# Altium project HGT-300.PrjPCB
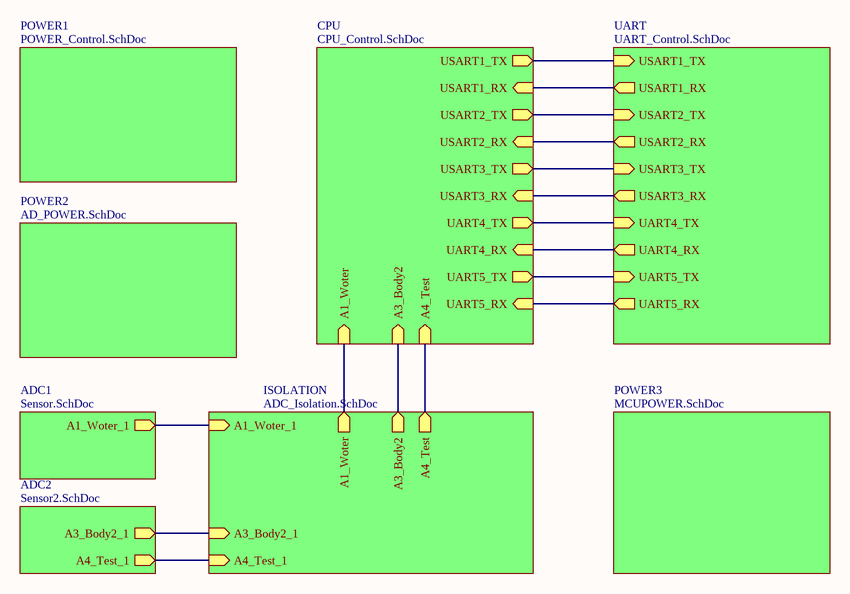
[diagram p0: SYSTEM_Control.SchDoc]
9 sheets, 434 parts. Net scope: hierarchical (ports join the sheet entries above them; power ports are global).
Board files: HGT-300.PcbDoc, 安装尺寸.PcbDoc, HGT-301.PcbDoc
Sheets:
  SYSTEM_Control.SchDoc
    CPU = CPU_Control.SchDoc
    POWER1 = POWER_Control.SchDoc
    UART = UART_Control.SchDoc
    POWER2 = AD_POWER.SchDoc
    ADC1 = Sensor.SchDoc
    ADC2 = Sensor2.SchDoc
    ISOLATION = ADC_Isolation.SchDoc
    POWER3 = MCUPOWER.SchDoc

## Sheet SYSTEM_Control.SchDoc
size A4

### Sub-sheets
ADC1 = Sensor.SchDoc: A1_Woter_1 (out)
ADC2 = Sensor2.SchDoc: A3_Body2_1 (out), A4_Test_1 (out)
CPU = CPU_Control.SchDoc: USART1_TX (out), USART1_RX (in), A1_Woter (in), A3_Body2 (in), A4_Test (in), UART4_TX (out), UART4_RX (in), UART5_TX (out), USART3_RX (in), USART3_TX (out), USART2_RX (in), USART2_TX (out), UART5_RX (in)
ISOLATION = ADC_Isolation.SchDoc: A1_Woter_1 (in), A3_Body2_1 (in), A4_Test_1 (in), A1_Woter (out), A3_Body2 (out), A4_Test (out)
POWER1 = POWER_Control.SchDoc: no entries
POWER2 = AD_POWER.SchDoc: no entries
POWER3 = MCUPOWER.SchDoc: no entries
UART = UART_Control.SchDoc: USART1_RX (out), USART1_TX (in), UART4_TX (in), UART4_RX (out), USART2_TX (in), USART2_RX (out), USART3_TX (in), UART5_TX (in), UART5_RX (out), USART3_RX (out)

### Nets
ADC1: sheet CPU/A3_Body2, sheet ISOLATION/A3_Body2
ADC2: sheet CPU/A4_Test, sheet ISOLATION/A4_Test
ADC3: sheet CPU/A1_Woter, sheet ISOLATION/A1_Woter
Pc12: sheet CPU/UART5_TX, sheet UART/UART5_TX
PD2: sheet CPU/UART5_RX, sheet UART/UART5_RX
UART4_RX: sheet CPU/UART4_RX, sheet UART/UART4_RX
UART4_TX: sheet CPU/UART4_TX, sheet UART/UART4_TX
NetC115_1: sheet ADC2/A3_Body2_1, sheet ISOLATION/A3_Body2_1
NetC124_1: sheet ADC2/A4_Test_1, sheet ISOLATION/A4_Test_1
NetC133_1: sheet ADC1/A1_Woter_1, sheet ISOLATION/A1_Woter_1
NetR27_1: sheet CPU/USART3_RX, sheet UART/USART3_RX
NetR28_1: sheet CPU/USART3_TX, sheet UART/USART3_TX
NetR31_1: sheet CPU/USART1_TX, sheet UART/USART1_TX
NetR32_1: sheet CPU/USART1_RX, sheet UART/USART1_RX
NetU2_86: sheet CPU/USART2_TX, sheet UART/USART2_TX
NetU2_87: sheet CPU/USART2_RX, sheet UART/USART2_RX

## Sheet CPU_Control.SchDoc
size A2
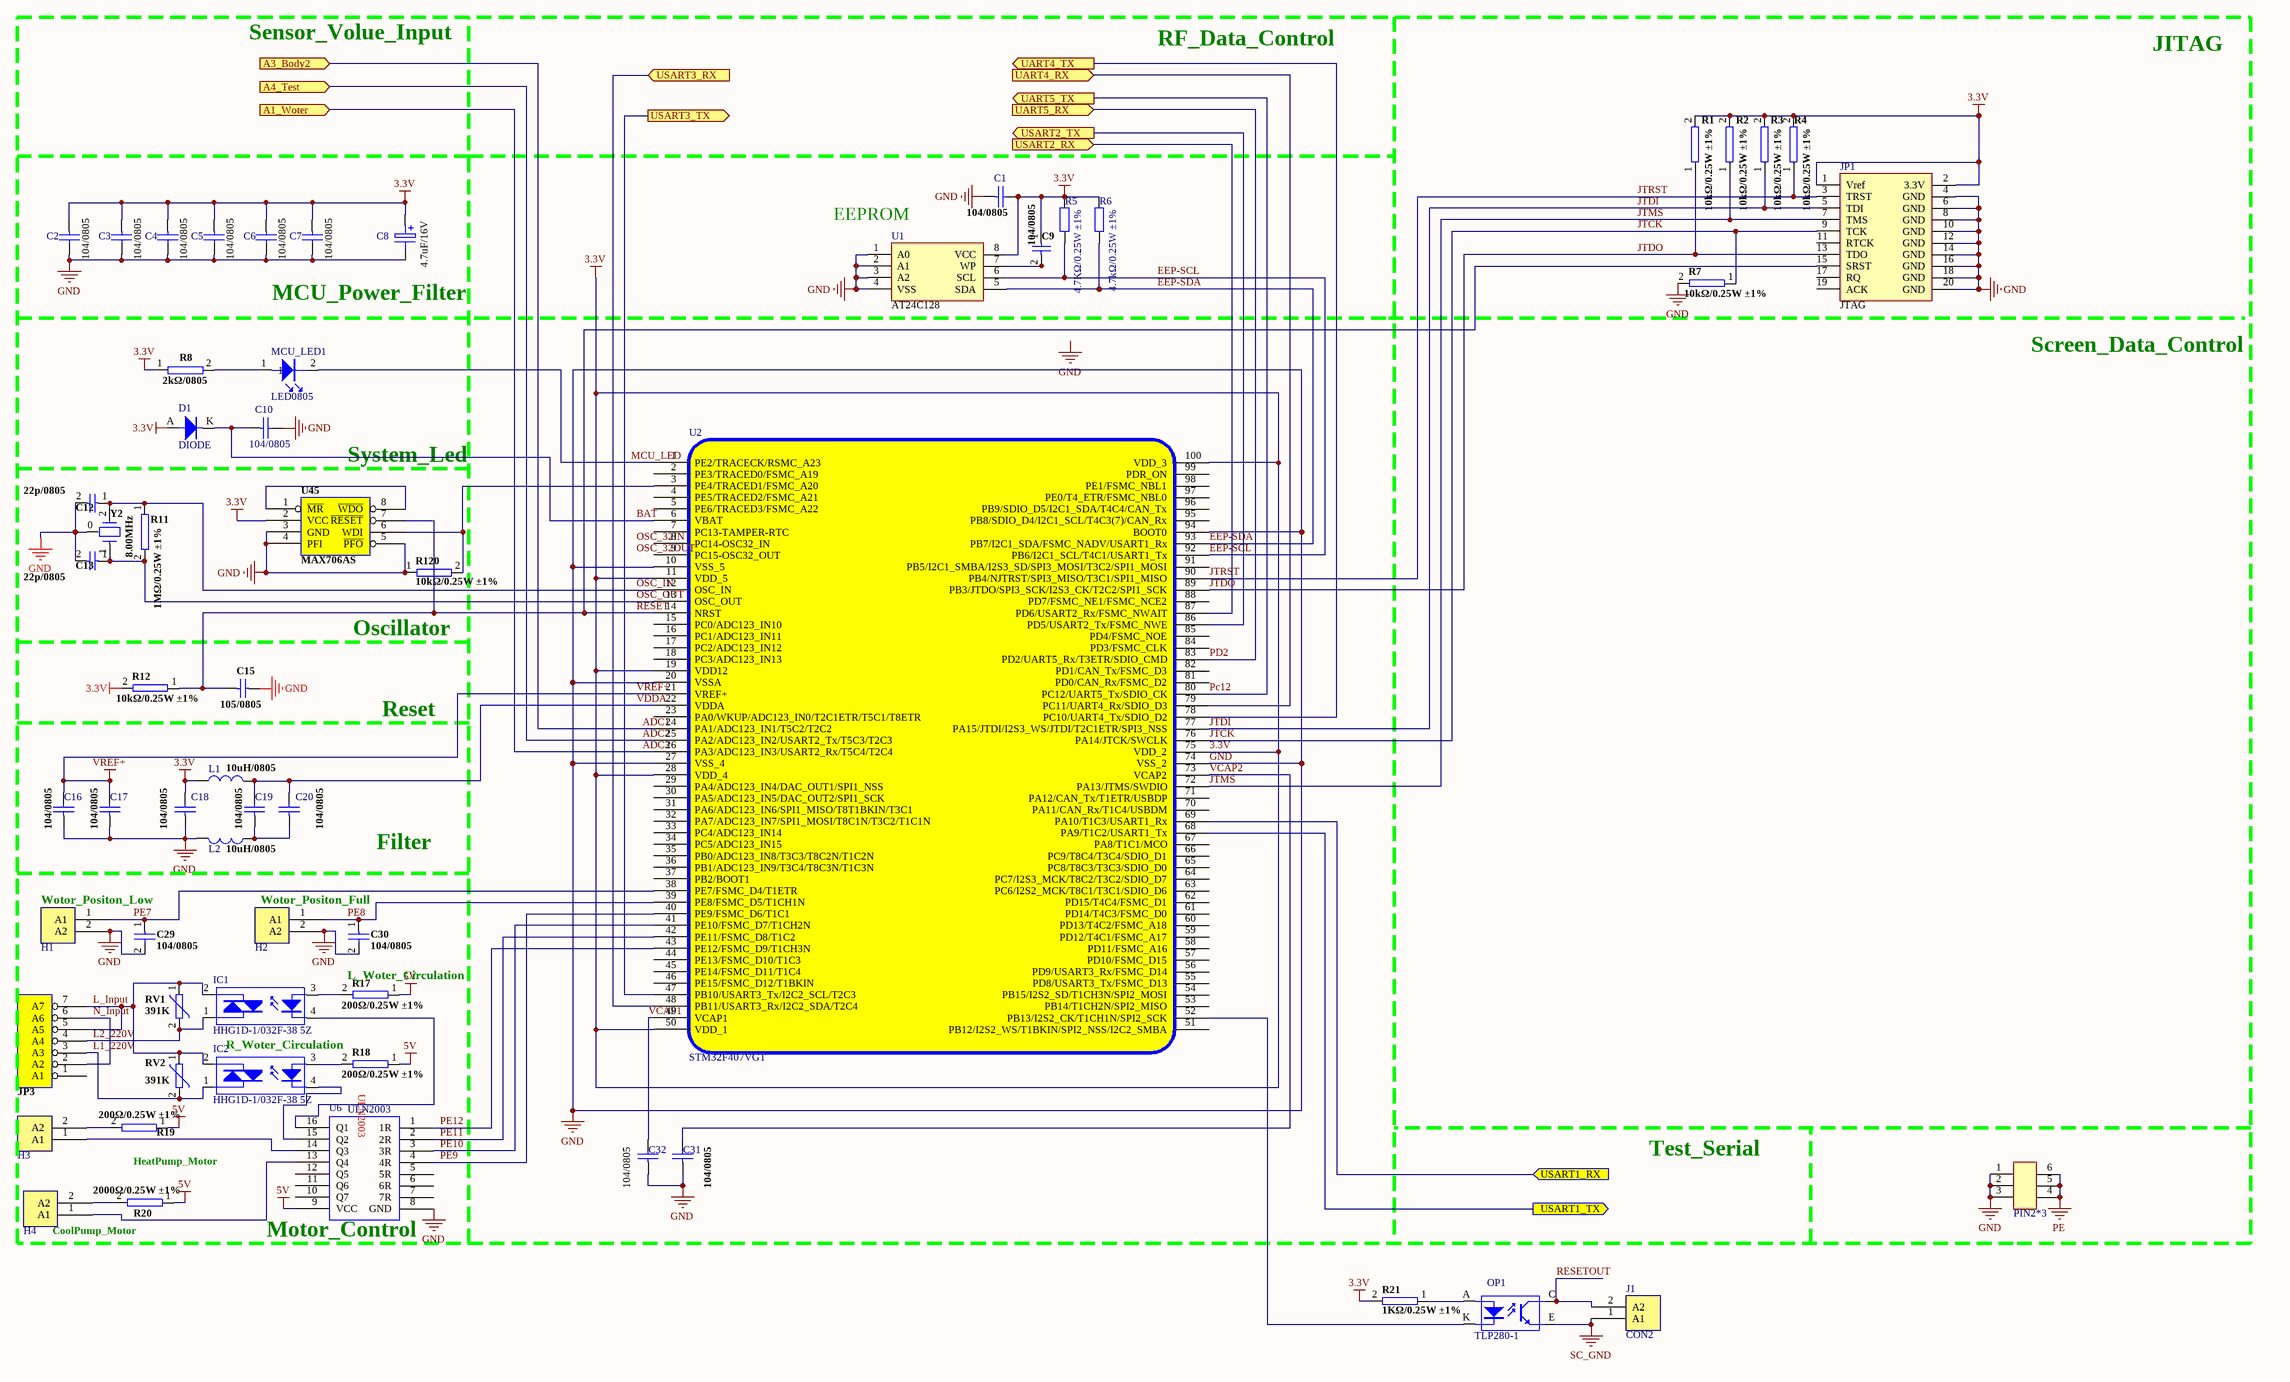
[diagram p1: CPU_Control.SchDoc]

### Parts
C1  104/0805  [C0805]
C2  104/0805  [C0805]
C3  104/0805  [C0805]
C4  104/0805  [C0805]
C5  104/0805  [C0805]
C6  104/0805  [C0805]
C7  104/0805  [C0805]
C8  4.7uF/16V  [CAP5X5]
C9  104/0805  [C0805]
C10  104/0805  [C0805]
C12  22p/0805  [C0805]
C13  22p/0805  [C0805]
C15  105/0805  [C0805]
C16  104/0805  [C0805]
C17  104/0805  [C0805]
C18  104/0805  [C0805]
C19  104/0805  [C0805]
C20  104/0805  [C0805]
C29  104/0805  [C0805]
C30  104/0805  [C0805]
C31  104/0805  [C0805]
C32  104/0805  [C0805]
D1  DIODE  [SOD123]
H1  L_Wotor_Port  [XH2]  (value not drawn)
H2  F_Wotor_Port  [XH2]  (value not drawn)
H3  Heat_Port  [XH2]  (value not drawn)
H4  Cool_Port  [XH2]  (value not drawn)
IC1  HHG1D-1/032F-38 5Z  [HHG1-REALY]
IC2  HHG1D-1/032F-38 5Z  [HHG1-REALY]
J1  CON2  [2Pin-2.54]
JP1  JTAG  [IDC20_A]
JP3  L_N_Port  [HEADER1x7]  (value not drawn)
L1  10uH/0805  [L0805]
L2  10uH/0805  [L0805]
MCU_LED1  LED0805  [LED_0805]
OP1  TLP280-1  [SOP4]
PE1  PIN2*3  [IDC2x3]
R1  10kΩ/0.25W ±1%  [R0805]
R2  10kΩ/0.25W ±1%  [R0805]
R3  10kΩ/0.25W ±1%  [R0805]
R4  10kΩ/0.25W ±1%  [R0805]
R5  4.7KΩ/0.25W ±1%  [R0805]
R6  4.7kΩ/0.25W ±1%  [R0805]
R7  10kΩ/0.25W ±1%  [R0805]
R8  2kΩ/0805  [R0805]
R11  1MΩ/0.25W ±1%  [R0805]
R12  10kΩ/0.25W ±1%  [R0805]
R17  200Ω/0.25W ±1%  [R0805]
R18  200Ω/0.25W ±1%  [R0805]
R19  200Ω/0.25W ±1%  [R0805]
R20  2000Ω/0.25W ±1%  [R0805]
R21  1KΩ/0.25W ±1%  [R0805]
R120  10kΩ/0.25W ±1%  [R0805]
RV1  391K  [RV0.3]
RV2  391K  [RV0.3]
U1  AT24C128  [SO-8]
U2  STM32F407VGT  [LQFP-100]
U6  ULN2003  [SOIC-16]
U45  MAX706AS  [SO-8]
Y2  8.00MHz  [XTAL_SOCKET]

### Ports
A1_Woter (in), A3_Body2 (in), A4_Test (in), UART4_RX (in), UART4_TX (out), UART5_RX (in), UART5_TX (out), USART1_RX (in), USART1_TX (out), USART2_RX (in), USART2_TX (out), USART3_RX (in), USART3_TX (out)

### Nets
3.3V: C1.2 C2.1 C3.1 C4.1 C5.1 C6.1 C7.1 C8.1 C9.1 C18.2 D1.A JP1.1(Vref) JP1.2(3.3V) L1.1 R1.2 R2.2 R3.2 R4.2 R5.2 R6.2 R8.1 R12.2 R21.2 U1.8(VCC) U2.11(VDD_5) U2.19(VDD12) U2.28(VDD_4) U2.50(VDD_1) U2.75(VDD_2) U2.100(VDD_3) U45.2(VCC)
5V: R17.1 R18.1 R19.1 R20.1 U6.9(VCC)
GND: C1.1 C2.2 C3.2 C4.2 C5.2 C6.2 C7.2 C8.2 C10.2 C12.2 C13.2 C15.1 C16.1 C17.1 C18.1 C29.2 C30.2 C31.1 C32.1 H1.2(A2) H2.2(A2) JP1.4(GND) JP1.6(GND) JP1.8(GND) JP1.10(GND) JP1.12(GND) JP1.14(GND) JP1.16(GND) JP1.18(GND) JP1.20(GND) L2.1 PE1.1 PE1.2 PE1.3 R7.2 R120.1 U1.1(A0) U1.2(A1) U1.3(A2) U1.4(VSS) U2.10(VSS_5) U2.20(VSSA) U2.27(VSS_4) U2.74(VSS_2) U2.94(BOOT0) U6.8(GND) U45.3(GND) U45.4(PFI) U45.5(~{PFO}) Y2.0
PE: PE1.4 PE1.5 PE1.6
SC_GND: J1.1(A1) OP1.E
VREF+: C16.2 C17.2 U2.21(VREF+)
ADC1: U2.24(PA1/ADC123_IN1/T5C2/T2C2) ; port A3_Body2
ADC2: U2.25(PA2/ADC123_IN2/USART2_Tx/T5C3/T2C3) ; port A4_Test
ADC3: U2.26(PA3/ADC123_IN3/USART2_Rx/T5C4/T2C4) ; port A1_Woter
BAT: C10.1 D1.K U2.6(VBAT)
EEP-SCL: R5.1 U1.6(SCL) U2.92(PB6/I2C1_SCL/T4C1/USART1_Tx)
EEP-SDA: R6.1 U1.5(SDA) U2.93(PB7/I2C1_SDA/FSMC_NADV/USART1_Rx)
JTCK: JP1.9(TCK) R7.1 U2.76(PA14/JTCK/SWCLK)
JTDI: JP1.5(TDI) R3.1 U2.77(PA15/JTDI/I2S3_WS/JTDI/T2C1ETR/SPI3_NSS)
JTDO: JP1.13(TDO) R1.1 U2.89(PB3/JTDO/SPI3_SCK/I2S3_CK/T2C2/SPI1_SCK)
JTMS: JP1.7(TMS) R2.1 U2.72(PA13/JTMS/SWDIO)
JTRST: JP1.3(TRST) R4.1 U2.90(PB4/NJTRST/SPI3_MISO/T3C1/SPI1_MISO)
L1_220V: IC2.1 JP3.3(A3) RV2.2
L2_220V: IC1.1 JP3.4(A4) RV1.2
L_Input: IC1.2 IC2.2 JP3.5(A5) JP3.7(A7) RV1.1 RV2.1
MCU_LED: MCU_LED1.2 U2.1(PE2/TRACECK/RSMC_A23)
N_Input: JP3.2(A2) JP3.6(A6)
OSC_IN: C12.1 R11.1 U2.12(OSC_IN) Y2.2
OSC_OUT: C13.1 R11.2 U2.13(OSC_OUT) Y2.1
Pc12: U2.80(PC12/UART5_Tx/SDIO_CK) ; port UART5_TX
PD2: U2.83(PD2/UART5_Rx/T3ETR/SDIO_CMD) ; port UART5_RX
PE7: C29.1 H1.1(A1) U2.38(PE7/FSMC_D4/T1ETR)
PE8: C30.1 H2.1(A1) U2.39(PE8/FSMC_D5/T1CH1N)
PE9: U2.40(PE9/FSMC_D6/T1C1) U6.4(4R)
PE10: U2.41(PE10/FSMC_D7/T1CH2N) U6.3(3R)
PE11: U2.42(PE11/FSMC_D8/T1C2) U6.2(2R)
PE12: U2.43(PE12/FSMC_D9/T1CH3N) U6.1(1R)
RESET: C15.2 JP1.15(SRST) R12.1 U2.14(NRST) U45.7(~{RESET})
RESETOUT: J1.2(A2) OP1.C
UART4_RX: U2.79(PC11/UART4_Rx/SDIO_D3) ; port UART4_RX
UART4_TX: U2.78(PC10/UART4_Tx/SDIO_D2) ; port UART4_TX
VCAP1: C32.2 U2.49(VCAP1)
VCAP2: C31.2 U2.73(VCAP2)
VDDA: C19.2 C20.2 L1.2 U2.22(VDDA)
NetC9_2: C9.2 U1.7(WP)
NetC19_1: C19.1 C20.1 L2.2
NetH3_1: H3.1(A1) U6.14(Q3)
NetH3_2: H3.2(A2) R19.2
NetH4_1: H4.1(A1) U6.13(Q4)
NetH4_2: H4.2(A2) R20.2
NetIC1_3: IC1.3 R17.2
NetIC1_4: IC1.4 U6.16(Q1)
NetIC2_3: IC2.3 R18.2
NetIC2_4: IC2.4 U6.15(Q2)
NetMCU_LED1_1: MCU_LED1.1 R8.2
NetOP1_A: OP1.A R21.1
NetOP1_K: OP1.K U2.52(PB13/I2S2_CK/T1CH1N/SPI2_SCK)
NetR27_1: U2.48(PB11/USART3_Rx/I2C2_SDA/T2C4) ; port USART3_RX
NetR28_1: U2.47(PB10/USART3_Tx/I2C2_SCL/T2C3) ; port USART3_TX
NetR31_1: U2.68(PA9/T1C2/USART1_Tx) ; port USART1_TX
NetR32_1: U2.69(PA10/T1C3/USART1_Rx) ; port USART1_RX
NetR120_2: R120.2 U2.3(PE4/TRACED1/FSMC_A20) U45.6(WDI)
NetU2_86: U2.86(PD5/USART2_Tx/FSMC_NWE) ; port USART2_TX
NetU2_87: U2.87(PD6/USART2_Rx/FSMC_NWAIT) ; port USART2_RX
NetU45_1: U45.1(~{MR}) U45.8(~{WDO})

Not connected (* = marked no-connect by the designer): JP1 11(RTCK) 17(RQ) 19(ACK); JP3 1(A1); U2 2(PE3/TRACED0/FSMC_A19) 4(PE5/TRACED2/FSMC_A21) 5(PE6/TRACED3/FSMC_A22) 7(PC13-TAMPER-RTC) 8(PC14-OSC32_IN) 9(PC15-OSC32_OUT) 15(PC0/ADC123_IN10) 16(PC1/ADC123_IN11) 17(PC2/ADC123_IN12) 18(PC3/ADC123_IN13) 23(PA0/WKUP/ADC123_IN0/T2C1ETR/T5C1/T8ETR) 29(PA4/ADC123_IN4/DAC_OUT1/SPI1_NSS) 30(PA5/ADC123_IN5/DAC_OUT2/SPI1_SCK) 31(PA6/ADC123_IN6/SPI1_MISO/T8T1BKIN/T3C1) 32(PA7/ADC123_IN7/SPI1_MOSI/T8C1N/T3C2/T1C1N) 33(PC4/ADC123_IN14) 34(PC5/ADC123_IN15) 35(PB0/ADC123_IN8/T3C3/T8C2N/T1C2N) 36(PB1/ADC123_IN9/T3C4/T8C3N/T1C3N) 37(PB2/BOOT1) 44(PE13/FSMC_D10/T1C3) 45(PE14/FSMC_D11/T1C4) 46(PE15/FSMC_D12/T1BKIN) 51(PB12/I2S2_WS/T1BKIN/SPI2_NSS/I2C2_SMBA) 53(PB14/T1CH2N/SPI2_MISO) 54(PB15/I2S2_SD/T1CH3N/SPI2_MOSI) 55(PD8/USART3_Tx/FSMC_D13) 56(PD9/USART3_Rx/FSMC_D14) 57(PD10/FSMC_D15) 58(PD11/FSMC_A16) 59(PD12/T4C1/FSMC_A17) 60(PD13/T4C2/FSMC_A18) 61(PD14/T4C3/FSMC_D0) 62(PD15/T4C4/FSMC_D1) 63(PC6/I2S2_MCK/T8C1/T3C1/SDIO_D6) 64(PC7/I2S3_MCK/T8C2/T3C2/SDIO_D7) 65(PC8/T8C3/T3C3/SDIO_D0) 66(PC9/T8C4/T3C4/SDIO_D1) 67(PA8/T1C1/MCO) 70(PA11/CAN_Rx/T1C4/USBDM) 71(PA12/CAN_Tx/T1ETR/USBDP) 81(PD0/CAN_Rx/FSMC_D2) 82(PD1/CAN_Tx/FSMC_D3) 84(PD3/FSMC_CLK) 85(PD4/FSMC_NOE) 88(PD7/FSMC_NE1/FSMC_NCE2) 91(PB5/I2C1_SMBA/I2S3_SD/SPI3_MOSI/T3C2/SPI1_MOSI) 95(PB8/SDIO_D4/I2C1_SCL/T4C3(7)/CAN_Rx) 96(PB9/SDIO_D5/I2C1_SDA/T4C4/CAN_Tx) 97(PE0/T4_ETR/FSMC_NBL0) 98(PE1/FSMC_NBL1) 99(PDR_ON); U6 5(5R) 6(6R) 7(7R) 10(Q7) 11(Q6) 12(Q5)

### Notes on the sheet
- Sensor_Volue_Input
- RF_Data_Control
- JITAG
- (near U1) EEPROM
- MCU_Power_Filter
- Screen_Data_Control
- (near U45) System_Led
- (near R120) Oscillator
- Reset
- Filter
- (near H1) Wotor_Positon_Low
- (near H2) Wotor_Positon_Full
- L_Woter_Circulation
- R_Woter_Circulation
- HeatPump_Motor
- Test_Serial
- (near H4) CoolPump_Motor
- (near U6) Motor_Control
- Labels drawn without touching a wire or pin: GND, OSC_32IN, OSC_32OUT

### Library data of the parts
C1-C7 C16-C20 C29-C32 = CAP: 贴片电容 104/25V ±1% C0805
C8 = ELECTRO1: 贴片钽电容 4.7uF/16V ±10% CAP5X5
C9 = CAP: 贴片电容 104/25V ±1% C0805; Part Field 1: 08-500106-06
C10 = CAP: 贴片电容 104/50V ±1% C0805
C12 C13 = CAP: 贴片电容 22pF/25V ±1% C0805
C15 = CAP: 贴片电容 105/25V ±1% C0805; Value: 100pF; Published: 8-Jun-2000; Revision: July-2002: Re-released for DXP Platform.; Publisher: Altium Limited
D1 = DIODE: 高速开关二极管 IN4148 1V 150mA SOD123
H1-H4 = CON2: 插座式端子 XH2.54-2P 250V(DC/AC) 3A
IC1 IC2 = OPTOTRIAC: 固态继电器 HHG1D-1/032F-38 5Z HHG1-REALY
J1 = CON2: 单排排针（2针）2.54mm 2Pin-2.54
JP1 = JTAG20: 双排排针（10针）2.54mm IDC20_A
JP3 = CON7: 接线端子 22-12AWG 300V 20A 间距8.5mm/HEADER1x7
L1 L2 = INDUCTOR1: 贴片电感 10uH/L0805/0.25W ±10%
MCU_LED1 = LED0805: 贴片LED灯 2.0V 20mA 蓝色 LED_0805
OP1 = TLP521: 光耦 TLP280-1 SOP4
PE1 = PIN2*3: 双排排针（3针）2.54mm IDC2x3
R1-R4 R7 R12 R120 = RES2: 贴片电阻 10kΩ 0.25W ±1% R0805
R5 = Res2: 贴片电阻 4.7kΩ 0.25W ±1% R0805; Value: 4.7K/0805; Published: 8-Jun-2000; LatestRevisionDate: 17-Jul-2002; LatestRevisionNote: Re-released for DXP Platform.; PackageReference: AXIAL-0.4; Publisher: Altium Limited
R6 = Res2: 贴片电阻 4.7kΩ/0.25W ±1% R0805; Value: 4.7ΩK/0.25W; Published: 8-Jun-2000; LatestRevisionDate: 17-Jul-2002; LatestRevisionNote: Re-released for DXP Platform.; PackageReference: AXIAL-0.4; Publisher: Altium Limited
R8 = RES2: 贴片电阻 2kΩ 0.25W ±1% R0805; Part Field 1: 06-115611-18
R11 = RES2: 贴片电阻 1MΩ 0.25W ±1% R0805
R17-R19 = RES2: 贴片电阻 200Ω 0.25W ±1% R0805
R20 = RES2: 贴片电阻 2kΩ 0.25W ±1% R0805
R21 = RES2: 贴片电阻 1kΩ 0.25W ±1% R0805
RV1 RV2 = VARISTOR: 压敏电阻 391K 340V ±10% RV0.3
U1 = 24WC02: 存储器 EEPROM 芯片 AT24C128 SO-8
U2 = STM32F407VGT: STM32F407单片机 STM32F407VGT LQFP-100
U6 = ULN2003: 达林顿三极管集成IC ULN2003 SOIC-16
U45 = MAX705CPA: 看门狗IC MAX706AS SO-8
Y2 = CRYSTAL: 晶振 8.00MHz XTAL_SOCKET; 物?: *; 部?: *; 供?: *

## Sheet POWER_Control.SchDoc
size A4
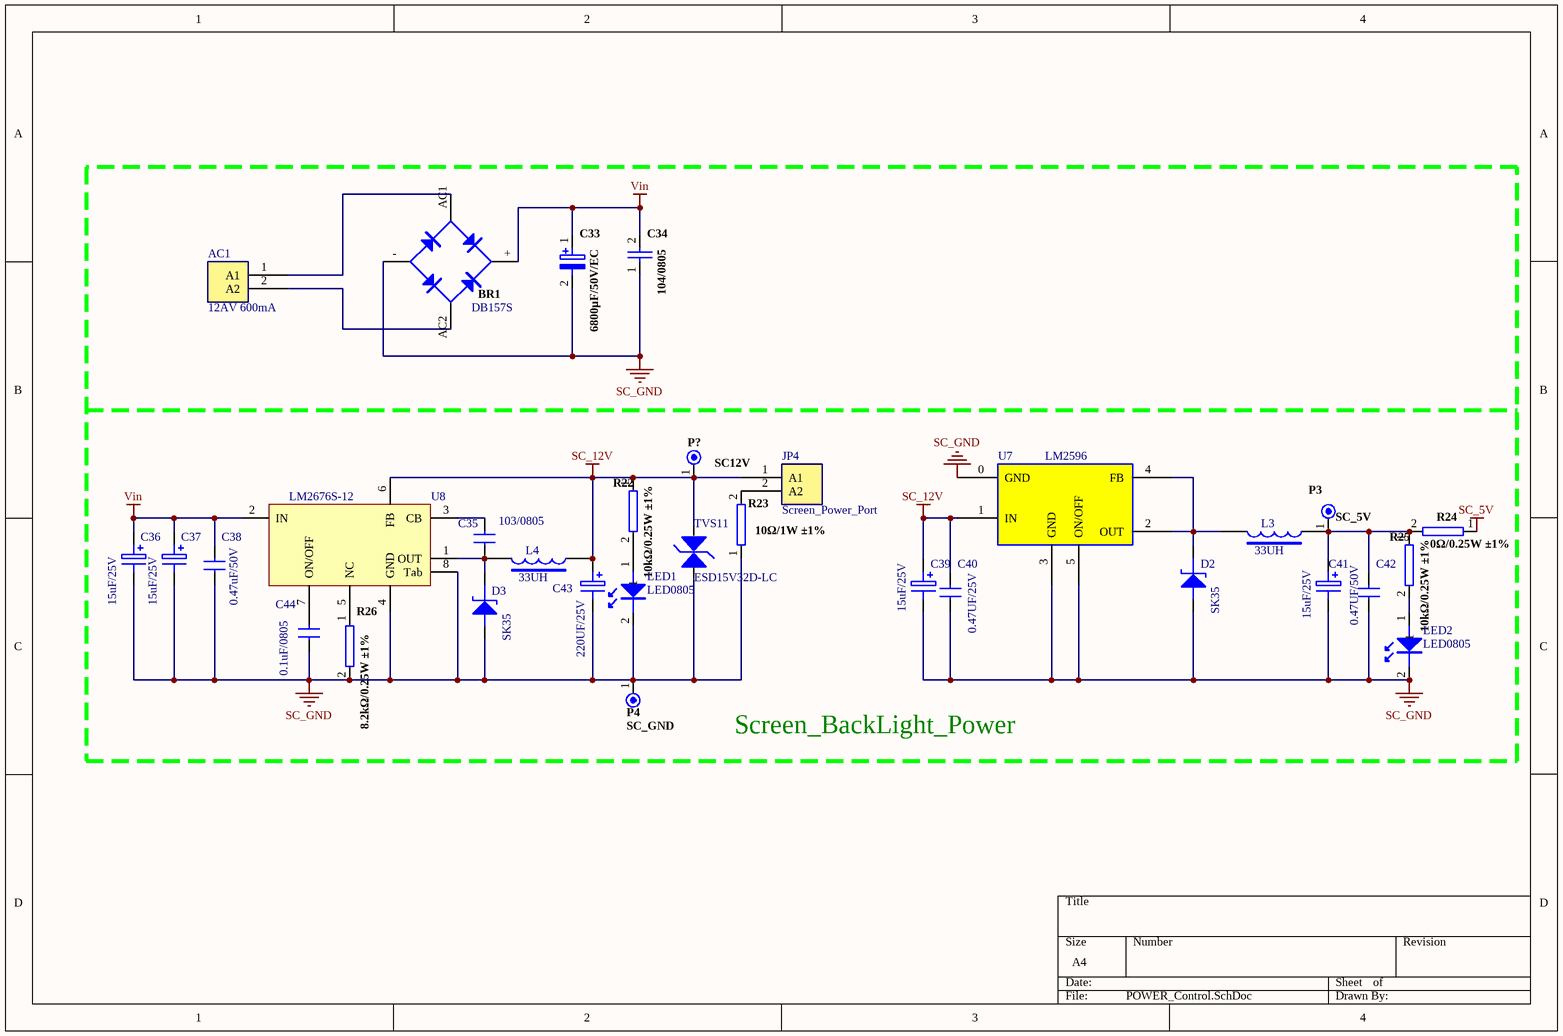
[diagram p2: POWER_Control.SchDoc]

### Parts
AC1  12AV 600mA  [HEADER2]
BR1  DB157S  [DB157S]
C33  6800μF/50V/EC  [RB.4/8]
C34  104/0805  [C0805]
C35  103/0805  [C0805]
C36  15uF/25V  [C6032]
C37  15uF/25V  [C6032]
C38  0.47uF/50V  [C0805]
C39  15uF/25V  [C6032]
C40  value 0.47UF/25V  [C0805]  (hidden comment: 0.47uF/50V)
C41  15uF/25V  [C6032]
C42  0.47uF/50V  [C0805]
C43  220UF/25V  [C10X10]
C44  value 0.1uF/0805  [C0805]  (hidden comment: 0.47UF/50V)
D2  SK35  [SMB-2]
D3  SK35  [SMB-2]
JP4  Screen_Power_Port  [HEADER1X2B]
L3  33UH  [M-SMB7X7]
L4  33UH  [M-SMB7X7]
LED1  LED0805  [LED_0805]
LED2  LED0805  [LED_0805]
P3  SC_5V  [TESTSMD]
P4  SC_GND  [TESTSMD]
P?  SC12V  [TESTSMD]
R22  10kΩ/0.25W ±1%  [R0805]
R23  10Ω/1W ±1%  [R0805]
R24  0Ω/0.25W ±1%  [R0805]
R25  10kΩ/0.25W ±1%  [R0805]
R26  8.2kΩ/0.25W ±1%  [R0805]
TVS11  ESD15V32D-LC  [SOD323]
U7  LM2596  [TO263]
U8  LM2676S-12  [TO-263-7]

### Blocks framed on the sheet
Screen_BackLight_Power: AC1 BR1 C33-C44 D2 D3 JP4 L3 L4 LED1 LED2 P3 P4 P? R22-R26 TVS11 U7 U8

### Nets
SC_5V: R24.1
SC_12V: C39.1 C40.2 C43.1 JP4.1(A1) L4.2 P?.1 R22.1 TVS11.1 U7.1(IN) U8.6(FB)
SC_GND: BR1.-(V-) C33.2 C34.1 C36.2 C37.2 C38.1 C39.2 C40.1 C41.2 C42.1 C43.2 C44.2 D2.1(A) D3.1(A) LED1.2 LED2.2 P4.1 R23.1 R26.2 TVS11.2 U7.0(GND) U7.3(GND) U7.5(ON/OFF) U8.4(GND) U8.8(Tab)
Vin: BR1.+(V+) C33.1 C34.2 C36.1 C37.1 C38.2 U8.2(IN)
NetAC1_1: AC1.1(A1) BR1.AC1
NetAC1_2: AC1.2(A2) BR1.AC2
NetC35_1: C35.1 U8.3(CB)
NetC35_2: C35.2 D3.2(K) L4.1 U8.1(OUT)
NetC41_1: C41.1 C42.2 L3.2 P3.1 R24.2 R25.1
NetC44_1: C44.1 U8.7(ON/OFF)
NetD2_2: D2.2(K) L3.1 U7.2(OUT) U7.4(FB)
NetJP4_2: JP4.2(A2) R23.2
NetLED1_1: LED1.1 R22.2
NetLED2_1: LED2.1 R25.2
NetR26_1: R26.1 U8.5(NC)

### Library data of the parts
AC1 = CON2: 接线端子 AWG14-22 300VAC 16A 5.0mm HEADER2
BR1 = NBRIDGE1: 贴片整流桥 DB157S 50A/1000V
C33 = ELECTRO2: 电解电容 6800μF/50V/EC ±5% RB.3/.6
C34 = CAP: 贴片电容 104/25V ±1% C0805
C35 = CAP: 贴片电容 103/25V ±1% C0805; Value: 103/0805
C36 C37 = ELECTRO1: 贴片钽电容 15uF/25V ±10% C6032; Comme: 15uF/25V/钽电容
C38 C40 C42 = CAP: 贴片电容 0.47uF/50V ±1% C0805
  C38 C42: Value: 0.47UF/50V
C39 C41 = ELECTRO1: 贴片钽电容 15uF/25V ±10% C6032
C43 = ELECTRO1: 贴片钽电容 220uF/25V ±10% C10X10
C44 = CAP: 贴片电容 0.47uF/25V ±1% C0805
D2 D3 = ZENER2: 稳压二极管 SK35 50V 3.0A SMB-2
JP4 = CON2: 连接器 WAFER 2PIN/3.96/自锁 HEADER1X2B
L3 L4 = INDUCTOR2: 贴片电感 33uH 1/4W ±10% M-SMB7X7
LED1 LED2 = LED0805: 贴片LED灯 蓝色 2.0V 20mA LED_0805
P3 P4 P? = CON1
R22 R25 = RES2: 贴片电阻 10kΩ 0.25W ±1% R0805; Part Field 1: 06-115611-18; Par: 电阻
R23 = RES2: 贴片电阻 10Ω/1W ±1% R0805
R24 = RES2: 贴片电阻 0Ω 0.25W ±1% R0805
R26 = RES2: 贴片电阻 8.2kΩ 0.25W ±1% R0805; Part Field 1: 06-115611-18; Par: 电阻
TVS11 = TVS: ESD静电二极管 ESD15V32D-LC 8V 15KV 40A SOD323
U7 = LM2596: 5VDC-DC开关电源IC LM2596 TO263
U8 = LM2676: 12DC-DC开关电源IC LM2676S-12 TO-263-7

## Sheet UART_Control.SchDoc
size A4
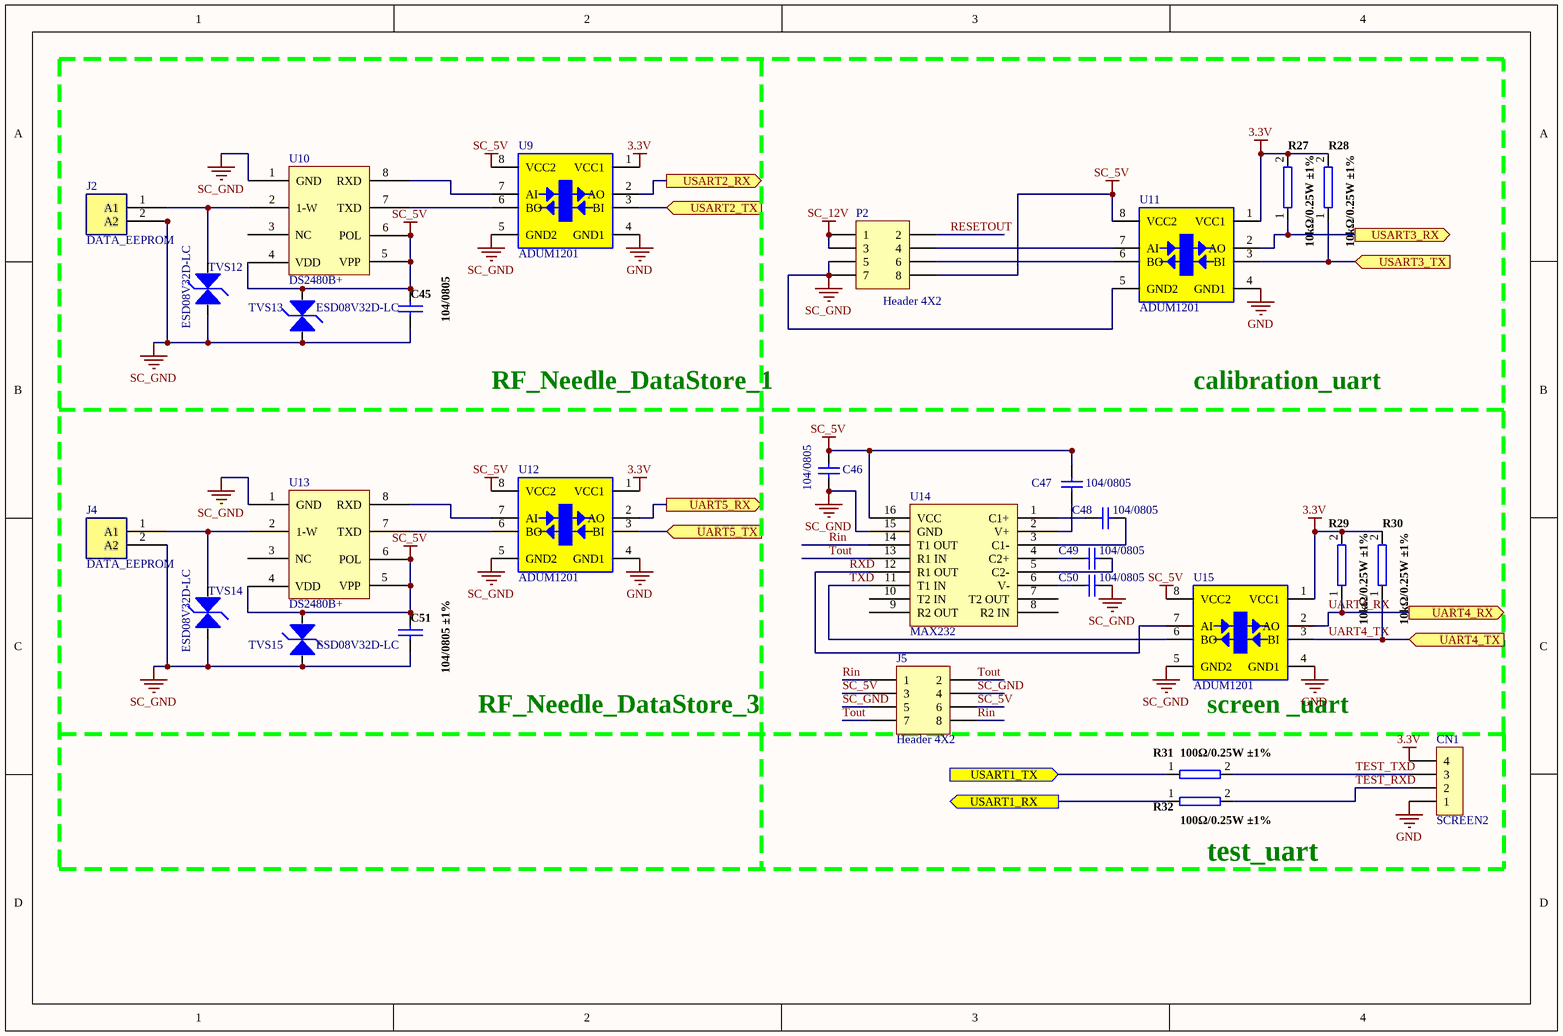
[diagram p3: UART_Control.SchDoc]

### Parts
C45  104/0805  [C0805]
C46  104/0805  [C0805]
C47  104/0805  [C0805]
C48  104/0805  [C0805]
C49  104/0805  [C0805]
C50  104/0805  [C0805]
C51  104/0805 ±1%  [C0805]
CN1  SCREEN2  [4Pin-2.54]
J2  DATA_EEPROM  [XH2]
J4  DATA_EEPROM  [XH2]
J5  Header 4X2  [IDC4*2]
P2  Header 4X2  [RJ45]
R27  10kΩ/0.25W ±1%  [R0805]
R28  10kΩ/0.25W ±1%  [R0805]
R29  10kΩ/0.25W ±1%  [R0805]
R30  10kΩ/0.25W ±1%  [R0805]
R31  100Ω/0.25W ±1%  [R0805]
R32  100Ω/0.25W ±1%  [R0805]
TVS12  ESD08V32D-LC  [SOD323]
TVS13  ESD08V32D-LC  [SOD323]
TVS14  ESD08V32D-LC  [SOD323]
TVS15  ESD08V32D-LC  [SOD323]
U9  ADUM1201  [SOIC8_N]
U10  DS2480B+  [SOIC8_N]
U11  ADUM1201  [SOIC8_N]
U12  ADUM1201  [SOIC8_N]
U13  DS2480B+  [SOIC8_N]
U14  MAX232  [SOP16]
U15  ADUM1201  [SOIC8_N]

### Ports
UART4_RX (out), UART4_TX (in), UART5_RX (out), UART5_TX (in), USART1_RX (out), USART1_TX (in), USART2_RX (out), USART2_TX (in), USART3_RX (out), USART3_TX (in)

### Nets
3.3V: CN1.4 R27.2 R28.2 R29.2 R30.2 U9.1(VCC1) U11.1(VCC1) U12.1(VCC1) U15.1(VCC1)
GND: CN1.1 U9.4(GND1) U11.4(GND1) U12.4(GND1) U15.4(GND1)
SC_5V: C45.2 C46.2 C47.1 C51.2 J5.3 J5.6 P2.8 TVS13.1 TVS15.1 U9.8(VCC2) U10.4(VDD) U10.5(VPP) U10.6(POL) U11.8(VCC2) U12.8(VCC2) U13.4(VDD) U13.5(VPP) U13.6(POL) U14.16(VCC) U15.8(VCC2)
SC_12V: P2.1 P2.3
SC_GND: C45.1 C46.1 C50.2 C51.1 J2.2(A2) J4.2(A2) J5.4 J5.5 P2.5 P2.7 TVS12.2 TVS13.2 TVS14.2 TVS15.2 U9.5(GND2) U10.1(GND) U11.5(GND2) U12.5(GND2) U13.1(GND) U14.15(GND) U15.5(GND2)
Pc12: U12.3(BI) ; port UART5_TX
PD2: U12.2(AO) ; port UART5_RX
RESETOUT: P2.2
Rin: J5.1 J5.8 U14.14(T1_OUT)
RXD: U14.12(R1_OUT) U15.7(AI)
TEST_RXD: CN1.2 R32.2
TEST_TXD: CN1.3 R31.2
Tout: J5.2 J5.7 U14.13(R1_IN)
TXD: U14.11(T1_IN) U15.6(BO)
UART4_RX: R29.1 U15.2(AO) ; port UART4_RX
UART4_TX: R30.1 U15.3(BI) ; port UART4_TX
NetC47_2: C47.2 U14.2(V+)
NetC48_1: C48.1 U14.1(C1+)
NetC48_2: C48.2 U14.3(C1-)
NetC49_1: C49.1 U14.4(C2+)
NetC49_2: C49.2 U14.5(C2-)
NetC50_1: C50.1 U14.6(V-)
NetJ2_1: J2.1(A1) TVS12.1 U10.2(1-W)
NetJ4_1: J4.1(A1) TVS14.1 U13.2(1-W)
NetP2_4: P2.4 U11.7(AI)
NetP2_6: P2.6 U11.6(BO)
NetR27_1: R27.1 U11.2(AO) ; port USART3_RX
NetR28_1: R28.1 U11.3(BI) ; port USART3_TX
NetR31_1: R31.1 ; port USART1_TX
NetR32_1: R32.1 ; port USART1_RX
NetU2_86: U9.3(BI) ; port USART2_TX
NetU2_87: U9.2(AO) ; port USART2_RX
NetU9_6: U9.6(BO) U10.7(TXD)
NetU9_7: U9.7(AI) U10.8(RXD)
NetU12_6: U12.6(BO) U13.7(TXD)
NetU12_7: U12.7(AI) U13.8(RXD)

Not connected (* = marked no-connect by the designer): U10 3(NC); U13 3(NC); U14 7(T2_OUT) 8(R2_IN) 9(R2_OUT) 10(T2_IN)

### Notes on the sheet
- RF_Needle_DataStore_1
- calibration_uart
- RF_Needle_DataStore_3
- (near U15) screen _uart
- (near R32) test_uart

### Library data of the parts
C45 C51 = CAP: 贴片电容 104/25V ±1% C0805; 物: *; 部: *; 供: *
C46 = Cap: 贴片电容 104/25V ±1% C0805; Published: 8-Jun-2000; LatestRevisionDate: 17-Jul-2002; LatestRevisionNote: Re-released for DXP Platform.; PackageReference: RAD-0.3; Publisher: Altium Limited
C47-C50 = Cap: 贴片电容 104/25V ±1% C0805; Value: 104; Published: 8-Jun-2000; LatestRevisionDate: 17-Jul-2002; LatestRevisionNote: Re-released for DXP Platform.; PackageReference: RAD-0.3; Publisher: Altium Limited
CN1 = CON4: 单排排针（4针） 2.54mm 4Pin-2.54
J2 J4 = CON2: 插座式端子 XH2.54-2P 250V(DC/AC) 3A
J5 = Header 4X2: 双排排针（4针） 2.54mm IDC4*2; LatestRevisionDate: 17-Jul-2002; LatestRevisionNote: Re-released for DXP Platform.; Publisher: Altium Limited
P2 = Header 4X2: RJ45插座 RJ45; LatestRevisionDate: 17-Jul-2002; LatestRevisionNote: Re-released for DXP Platform.; Publisher: Altium Limited
R27-R30 = RES2: 贴片电阻 10kΩ 0.25W ±1% R0805
R31 R32 = RES2: 贴片电阻 100Ω 0.25W ±1% R0805
TVS12-TVS15 = TVS: ESD静电二极管 ESD08V32D-LC 5V 15KV 40A SOD323
U9 U11 U12 U15 = ADUM1201: 双通道数字隔离器 ADUM1201 SOIC8_N
U10 U13 = DS2480B+: 1-Wire线驱动器 DS2480B SOIC8_N
U14 = MAX232_DIP16: 串口通信转换芯片 MAX232 SOP16

## Sheet AD_POWER.SchDoc
size A3
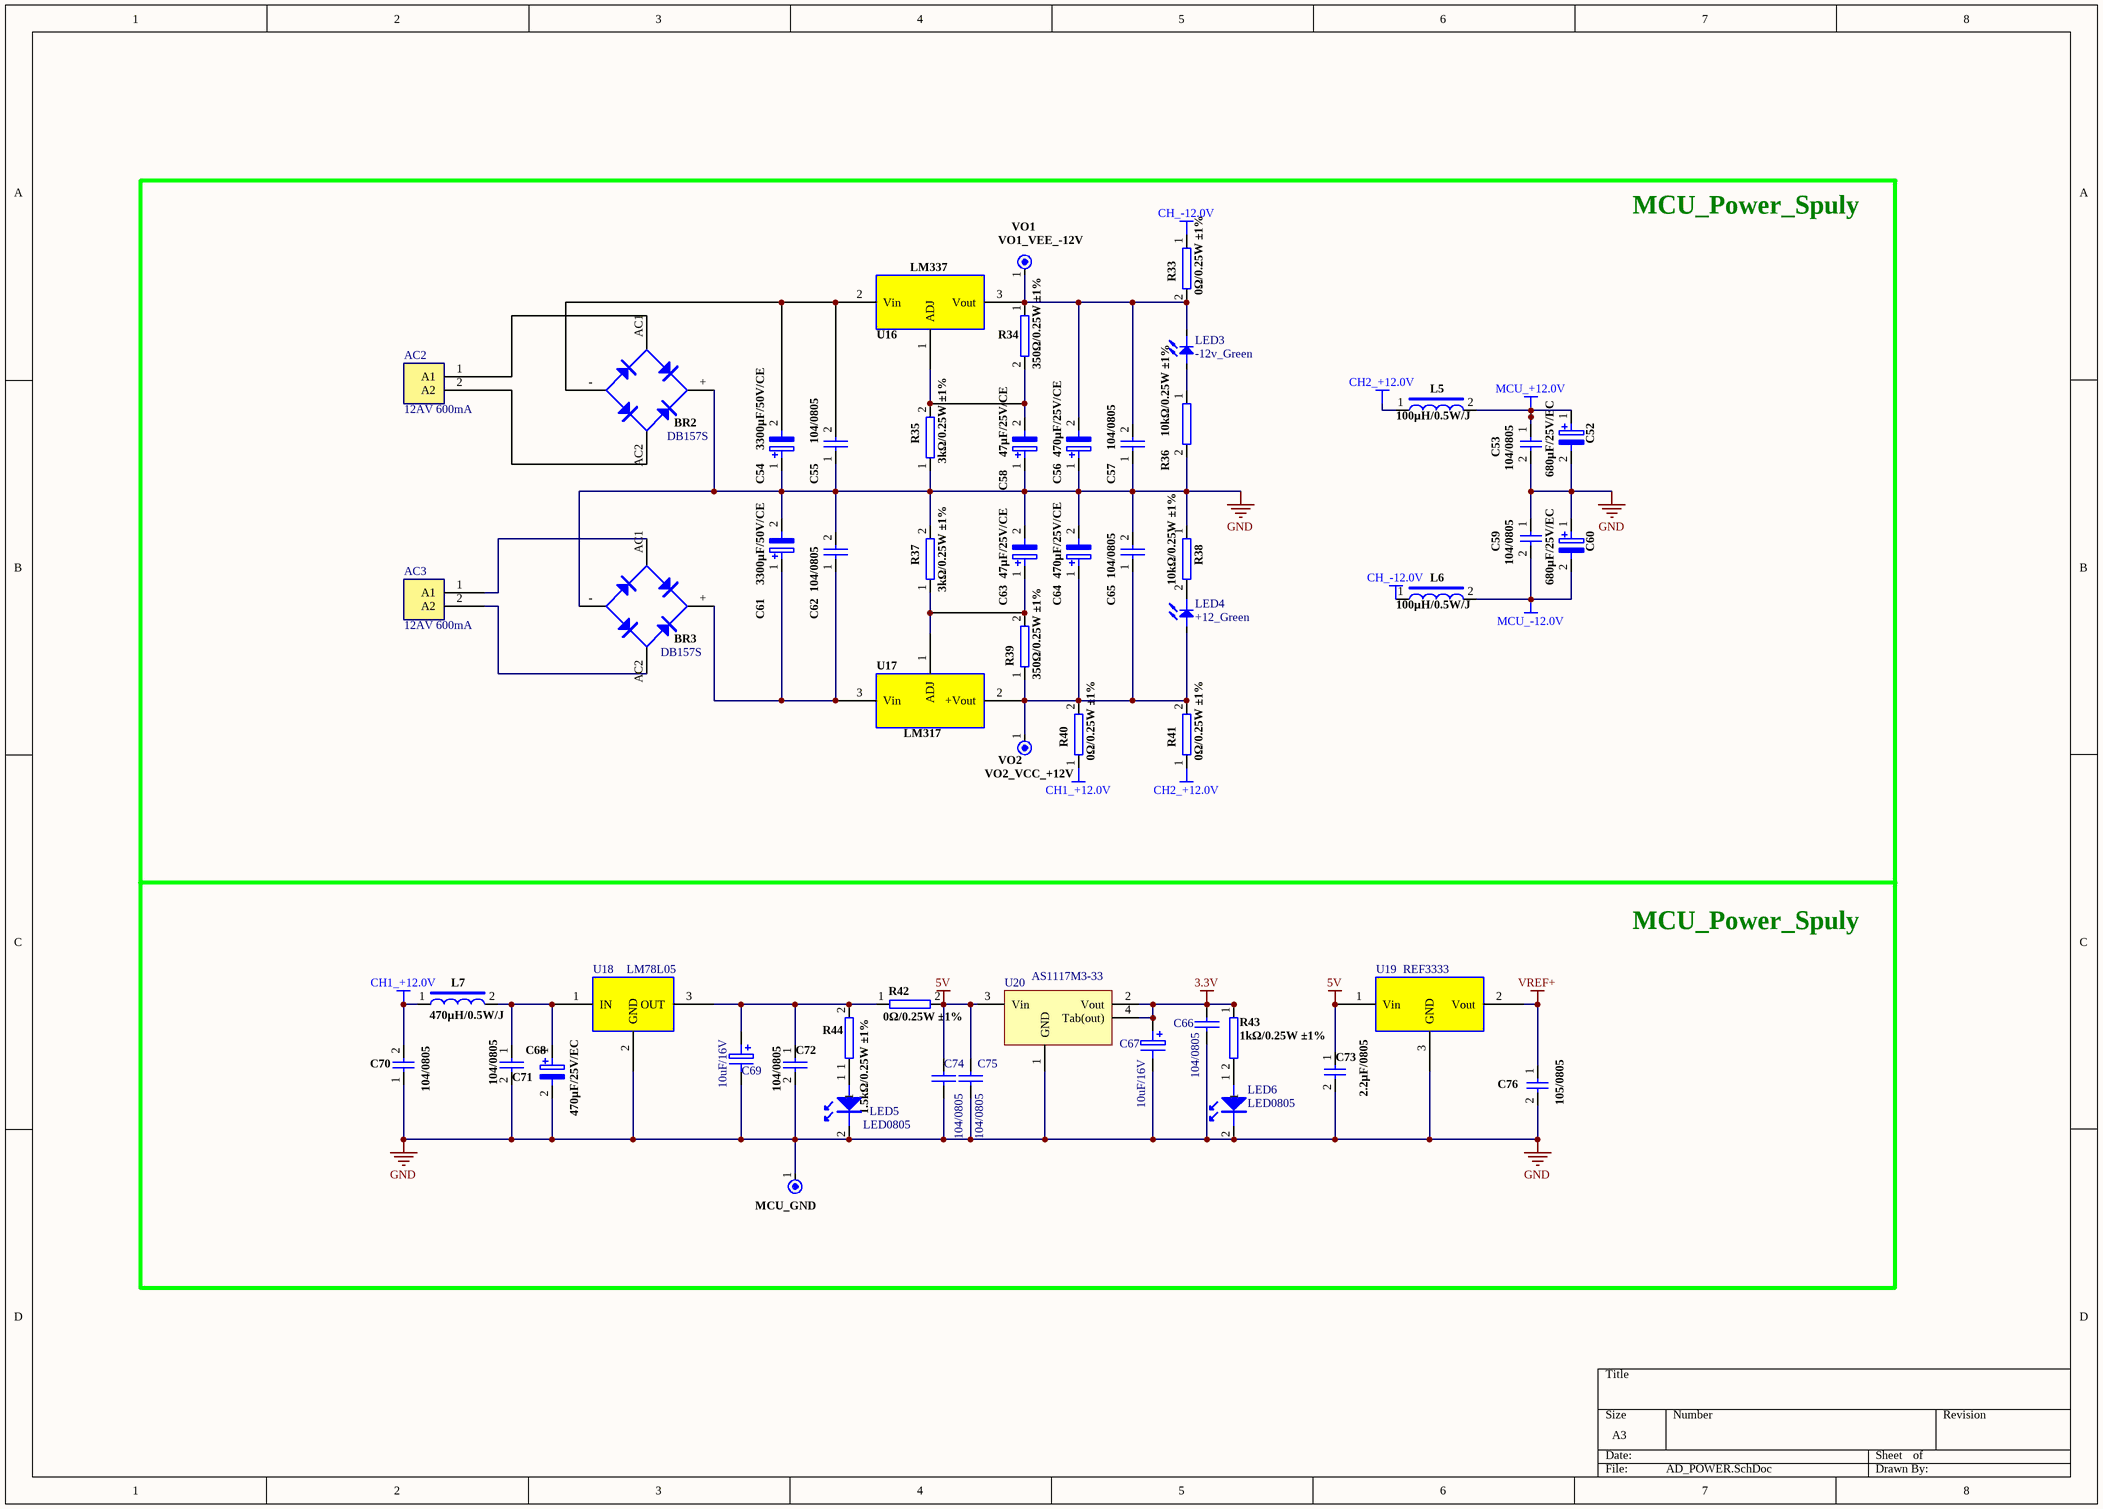
[diagram p4: AD_POWER.SchDoc]

### Parts
AC2  12AV 600mA  [HEADER2]
AC3  12AV 600mA  [HEADER2]
BR2  DB157S  [DB157S]
BR3  DB157S  [DB157S]
C52  680μF/25V/EC  [RB.2/.4]
C53  104/0805  [C0805]
C54  3300μF/50V/CE  [RB.3/.6]
C55  104/0805  [C0805]
C56  470μF/25V/CE  [RB.2/.4]
C57  104/0805  [C0805]
C58  47μF/25V/CE  [RB.1/.2]
C59  104/0805  [C0805]
C60  680μF/25V/EC  [RB.2/.4]
C61  3300μF/50V/CE  [RB.3/.6]
C62  104/0805  [C0805]
C63  47μF/25V/CE  [RB.1/.2]
C64  470μF/25V/CE  [RB.2/.4]
C65  104/0805  [C0805]
C66  104/0805  [C0805]
C67  10uF/16V  [C3216]
C68  470μF/25V/EC  [RB.2/.4]
C69  10uF/16V  [C3216]
C70  104/0805  [C0805]
C71  104/0805  [C0805]
C72  104/0805  [C0805]
C73  2.2μF/0805  [C0805]
C74  104/0805  [C0805]
C75  104/0805  [C0805]
C76  105/0805  [C0805]
L5  100μH/0.5W/J  [AXIAL0.4]
L6  100μH/0.5W/J  [AXIAL0.4]
L7  470μH/0.5W/J  [AXIAL0.4]
LED3  -12v_Green  [LED_0805]
LED4  +12_Green  [LED_0805]
LED5  LED0805  [LED_0805]
LED6  LED0805  [LED_0805]
MCU_GND1  MCU_GND  [TESTSMD]
R33  0Ω/0.25W ±1%  [R0805]
R34  350Ω/0.25W ±1%  [R0805]
R35  3kΩ/0.25W ±1%  [R0805]
R36  10kΩ/0.25W ±1%  [R0805]
R37  3kΩ/0.25W ±1%  [R0805]
R38  10kΩ/0.25W ±1%  [R0805]
R39  350Ω/0.25W ±1%  [R0805]
R40  0Ω/0.25W ±1%  [R0805]
R41  0Ω/0.25W ±1%  [R0805]
R42  0Ω/0.25W ±1%  [R0805]
R43  1kΩ/0.25W ±1%  [R0805]
R44  1.5kΩ/0.25W ±1%  [R0805]
U16  LM337  [TO220H]
U17  LM317  [TO220H]
U18  LM78L05  [TO-220]
U19  REF3333  [SOT-23-B]
U20  AS1117M3-33  [SOT-223-3L(M3)]
VO1  VO1_VEE_-12V  [TESTSMD]
VO2  VO2_VCC_+12V  [TESTSMD]

### Nets
3.3V: C66.1 C67.1 R43.1 U20.2(Vout) U20.4(Tab(out))
5V: C73.1 C74.1 C75.1 R42.2 U19.1(Vin) U20.3(Vin)
CH1_+12.0V: C70.2 L7.1 R40.1
CH2_+12.0V: L5.1 R41.1
CH_-12.0V: L6.1 R33.1
GND: BR2.+(V+) BR3.-(V-) C52.2 C53.2 C54.1 C55.1 C56.1 C57.1 C58.1 C59.1 C60.1 C61.2 C62.2 C63.2 C64.2 C65.2 C66.2 C67.2 C68.2 C69.2 C70.1 C71.2 C72.2 C73.2 C74.2 C75.2 C76.2 LED5.2 LED6.2 MCU_GND1.1 R35.1 R36.2 R37.2 R38.1 U18.2(GND) U19.3(GND) U20.1(GND)
MCU_+12.0V: C52.1 C53.1 L5.2
MCU_-12.0V: C59.2 C60.2 L6.2
VREF+: C76.1 U19.2(Vout)
NetAC2_1: AC2.1(A1) BR2.AC1
NetAC2_2: AC2.2(A2) BR2.AC2
NetAC3_1: AC3.1(A1) BR3.AC1
NetAC3_2: AC3.2(A2) BR3.AC2
NetBR2_-: BR2.-(V-) C54.2 C55.2 U16.2(Vin)
NetBR3_+: BR3.+(V+) C61.1 C62.1 U17.3(Vin)
NetC56_2: C56.2 C57.2 LED3.2 R33.2 R34.1 U16.3(Vout) VO1.1
NetC58_2: C58.2 R34.2 R35.2 U16.1(ADJ)
NetC63_1: C63.1 R37.1 R39.2 U17.1(ADJ)
NetC64_1: C64.1 C65.1 LED4.1 R39.1 R40.2 R41.2 U17.2(+Vout) VO2.1
NetC68_1: C68.1 C71.1 L7.2 U18.1(IN)
NetC69_1: C69.1 C72.1 R42.1 R44.2 U18.3(OUT)
NetLED3_1: LED3.1 R36.1
NetLED4_2: LED4.2 R38.2
NetLED5_1: LED5.1 R44.1
NetLED6_1: LED6.1 R43.2

### Notes on the sheet
- MCU_Power_Spuly

### Library data of the parts
AC2 AC3 = CON2: 接线端子 AWG14-22 300VAC 16A 5.0mm HEADER2
BR2 BR3 = NBRIDGE1: 贴片整流桥 DB157S 50A/1000V
C52 C60 = ELECTRO2: 电解电容 680μF/25V/EC ±10% RB.2/.4
C53 C55 C57 C59 C62 C65 C66 C70-C72 C74 C75 = CAP: 贴片电容 104/25V ±1% C0805
  C74 C75: value: *
C54 C61 = ELECTRO2: 电解电容 3300μF/50V ±10% RB.3/.6
C56 C64 = ELECTRO2: 电解电容 470μF/25V/CE ±10% RB.2/.4
C58 C63 = ELECTRO2: 电解电容 47μF/25V ±10% RB.1/.2
C67 C69 = ELECTRO1: 贴片钽电容 10uF/16V ±10% C3216
C68 = ELECTRO2: 电解电容 470μF/25V/EC ±10% RB.2/.4
C73 = CAP: 贴片电容 2.2μF/50V ±1% C0805
C76 = CAP: 贴片电容 105/25V ±1% C0805
L5 L6 = INDUCTOR2: 直插电感 100μH/0.5W/J ±5% AXIAL0.4
L7 = INDUCTOR2: 直插电感 470μH/0.5W ±5% AXIAL0.4
LED3 = B_LED: 贴片LED灯 绿色 2.0V 20mA  LED_0805
LED4 = B_LED: 贴片LED灯 绿色 2.0V 20mA LED_0805
LED5 LED6 = LED0805: 贴片LED灯 蓝色 2.0V 20mA LED_0805
MCU_GND1 VO2 = CON1
R33 R40-R42 = RES2: 贴片电阻 0Ω 0.25W ±1% R0805
R34 R39 = RES2: 贴片电阻 350Ω 0.25W ±1% R0805
R35 R37 = RES2: 贴片电阻 3kΩ 0.25W ±1% R0805
R36 R38 = RES2: 贴片电阻 10kΩ 0.25W ±1% R0805
R43 = RES2: 贴片电阻 1kΩ 0.25W ±1% R0805; Part Field 1: 06-115611-18
R44 = RES2: 贴片电阻 1.5kΩ 0.25W ±1% R0805
U16 = LM337: 线性可调稳压IC LM337 TO220H
U17 = LM317: 线性可调稳压IC  LM317 TO-220H
U18 = LM78L05: 线性稳压芯片 LM78L05 TO-220
U19 = REF33XX: 3.3V电压基准芯片 REF3333 SOT-23-B; 物?: *; 部?: *; 供?: *
U20 = AS1117M3-33: 线性稳压管 AS1117M3-33 SOT-223; 物?: *; 部?: *; 供?: *
VO1 = CON1: 测试点

## Sheet Sensor.SchDoc
size A3
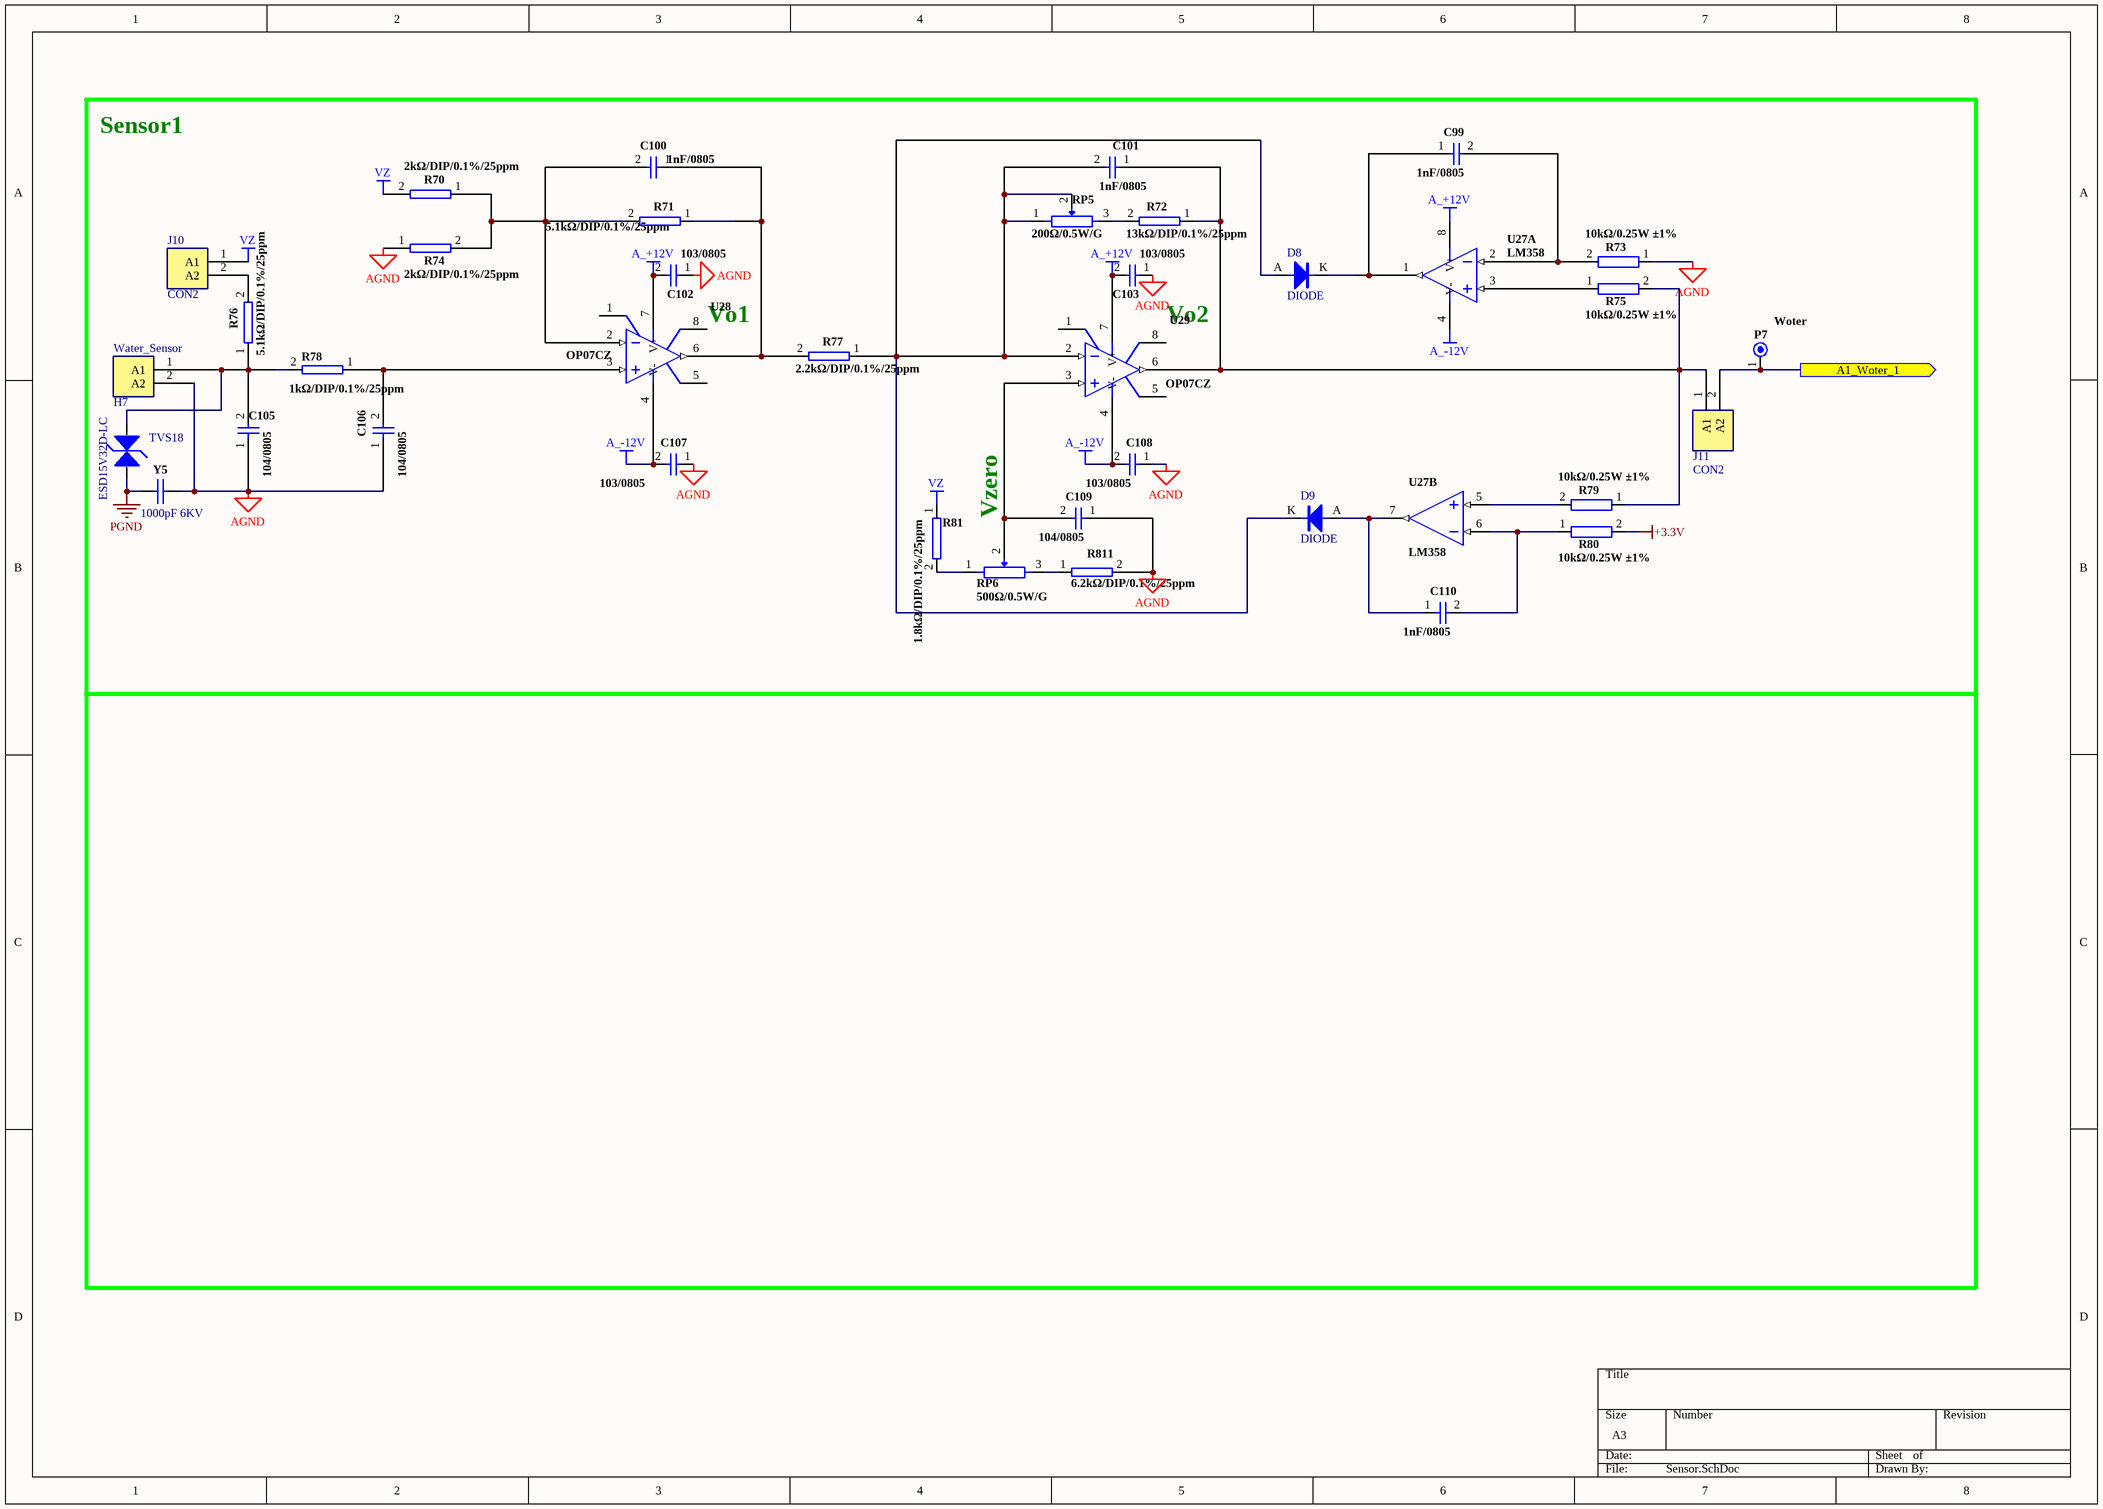
[diagram p5: Sensor.SchDoc]

### Parts
C99  1nF/0805  [C0805]
C100  1nF/0805  [C0805]
C101  1nF/0805  [C0805]
C102  103/0805  [C0805]
C103  103/0805  [C0805]
C105  104/0805  [C0805]
C106  104/0805  [C0805]
C107  103/0805  [C0805]
C108  103/0805  [C0805]
C109  104/0805  [C0805]
C110  1nF/0805  [C0805]
D8  DIODE  [SOD123]
D9  DIODE  [SOD123]
H7  Water_Sensor  [XH2]
J10  CON2  [2Pin-2.54]
J11  CON2  [2Pin-2.54]
P7  Woter  [TESTSMD]
R70  2kΩ/DIP/0.1%/25ppm  [AXIAL0.4]
R71  5.1kΩ/DIP/0.1%/25ppm  [AXIAL0.4]
R72  13kΩ/DIP/0.1%/25ppm  [AXIAL0.4]
R73  10kΩ/0.25W ±1%  [R0805]
R74  2kΩ/DIP/0.1%/25ppm  [AXIAL0.4]
R75  10kΩ/0.25W ±1%  [R0805]
R76  5.1kΩ/DIP/0.1%/25ppm  [AXIAL0.4]
R77  2.2kΩ/DIP/0.1%/25ppm  [AXIAL0.4]
R78  1kΩ/DIP/0.1%/25ppm  [AXIAL0.4]
R79  10kΩ/0.25W ±1%  [R0805]
R80  10kΩ/0.25W ±1%  [R0805]
R81  1.8kΩ/DIP/0.1%/25ppm  [AXIAL0.4]
R811  6.2kΩ/DIP/0.1%/25ppm  [AXIAL0.4]
RP5  200Ω/0.5W/G  [3224W]
RP6  500Ω/0.5W/G  [3224W]
TVS18  ESD15V32D-LC  [SOD323]
U27  LM358  [SO-8]  (parts A,B of 2)
U28  OP07CZ  [SO-8]
U29  OP07CZ  [SO-8]
Y5  1000pF 6KV  [CY1002]

### Ports
A1_Woter_1 (out)

### Nets
+3.3V: R80.2
A_+12V: C102.2 C103.2 U27.8(V+) U28.7(V+) U29.7(V+)
A_-12V: C107.2 C108.2 U27.4(V-) U28.4(V-) U29.4(V-)
AGND: C102.1 C103.1 C105.1 C106.1 C107.1 C108.1 C109.1 H7.2(A2) R73.1 R74.1 R811.2 Y5.2
PGND: TVS18.2 Y5.1
VZ: J10.1(A1) R70.2 R81.1
NetC99_1: C99.1 D8.K U27.1
NetC99_2: C99.2 R73.2 U27.2
NetC100_1: C100.1 R71.1 R77.2 U28.6
NetC100_2: C100.2 R70.1 R71.2 R74.2 U28.2
NetC101_1: C101.1 J11.1(A1) R72.1 R75.2 R79.1 U29.6
NetC101_2: C101.2 D8.A D9.K R77.1 RP5.1 RP5.2 U29.2
NetC105_2: C105.2 H7.1(A1) R76.1 R78.2 TVS18.1
NetC106_2: C106.2 R78.1 U28.3
NetC109_2: C109.2 RP6.2 U29.3
NetC110_1: C110.1 D9.A U27.7
NetC110_2: C110.2 R80.1 U27.6
NetC133_1: J11.2(A2) P7.1 ; port A1_Woter_1
NetJ10_2: J10.2(A2) R76.2
NetR72_2: R72.2 RP5.3
NetR75_1: R75.1 U27.3
NetR79_2: R79.2 U27.5
NetR81_2: R81.2 RP6.1
NetR811_1: R811.1 RP6.3

Not connected (* = marked no-connect by the designer): U28 1 5 8; U29 1 5 8

### Notes on the sheet
- Sensor1
- Vo1
- Vo2
- Vzero

### Library data of the parts
C99-C101 C110 = CAP: 贴片电容 1nF/25V ±1% C0805
C102 C103 C107 C108 = CAP: 贴片电容 103/25V ±1% C0805
C105 C106 C109 = CAP: 贴片电容 104/25V ±1% C0805
D8 D9 = DIODE: 高速开关二极管 IN4148 1V 150mA SOD123
H7 = CON2: 插座式端子 XH2.54-2P 250V(DC/AC) 3A
J10 J11 = CON2: 单排排针（2针）2.54mm 2Pin-2.54
P7 = CON1: 测试点
R70 R74 = RES2: 高精度电阻 2kΩ DIP 0.25W ±0.1% 25ppm AXIAL0.4
R71 R76 = RES2: 高精度电阻 5.1kΩ DIP 0.25W ±0.1% 25ppm AXIAL0.4
R72 = RES2: 高精度电阻 13kΩ DIP 0.25W ±0.1% 25ppm AXIAL0.4
R73 R75 R79 R80 = RES2: 贴片电阻 10kΩ 0.25W ±1% R0805
R77 = RES2: 高精度电阻 2.2kΩ DIP 0.25W ±0.1% 25ppm AXIAL0.4
R78 = RES2: 高精度电阻 1kΩ DIP 0.25W ±0.1% 25ppm AXIAL0.4
R81 = RES2: 高精度电阻 1.8kΩ 0.25W ±0.1% 25ppm AXIAL0.4
R811 = RES2: 高精度电阻 6.2kΩ DIP 0.25W ±0.1% 25ppm AXIAL0.4
RP5 = RPOT: 高精密可调电位器 200Ω/0.5W/G 3224W
RP6 = RPOT: 高精密可调电位器 500Ω/0.5W/G 3224W
TVS18 = TVS: ESD静电二极管 ESD15V32D-LC 15V 15KV 40A SOD323
U27 = MC1458D: 双运算放大器 LM358 SO-8
U28 U29 = OP07CZ: 运算放大器 OP07CZ SO-8
Y5 = CAP: 安规电容 1000pF 6KV ±20% CY1002; C: 1000PF/安规Y; 物: *; 部: *; 供: *

## Sheet Sensor2.SchDoc
size A3
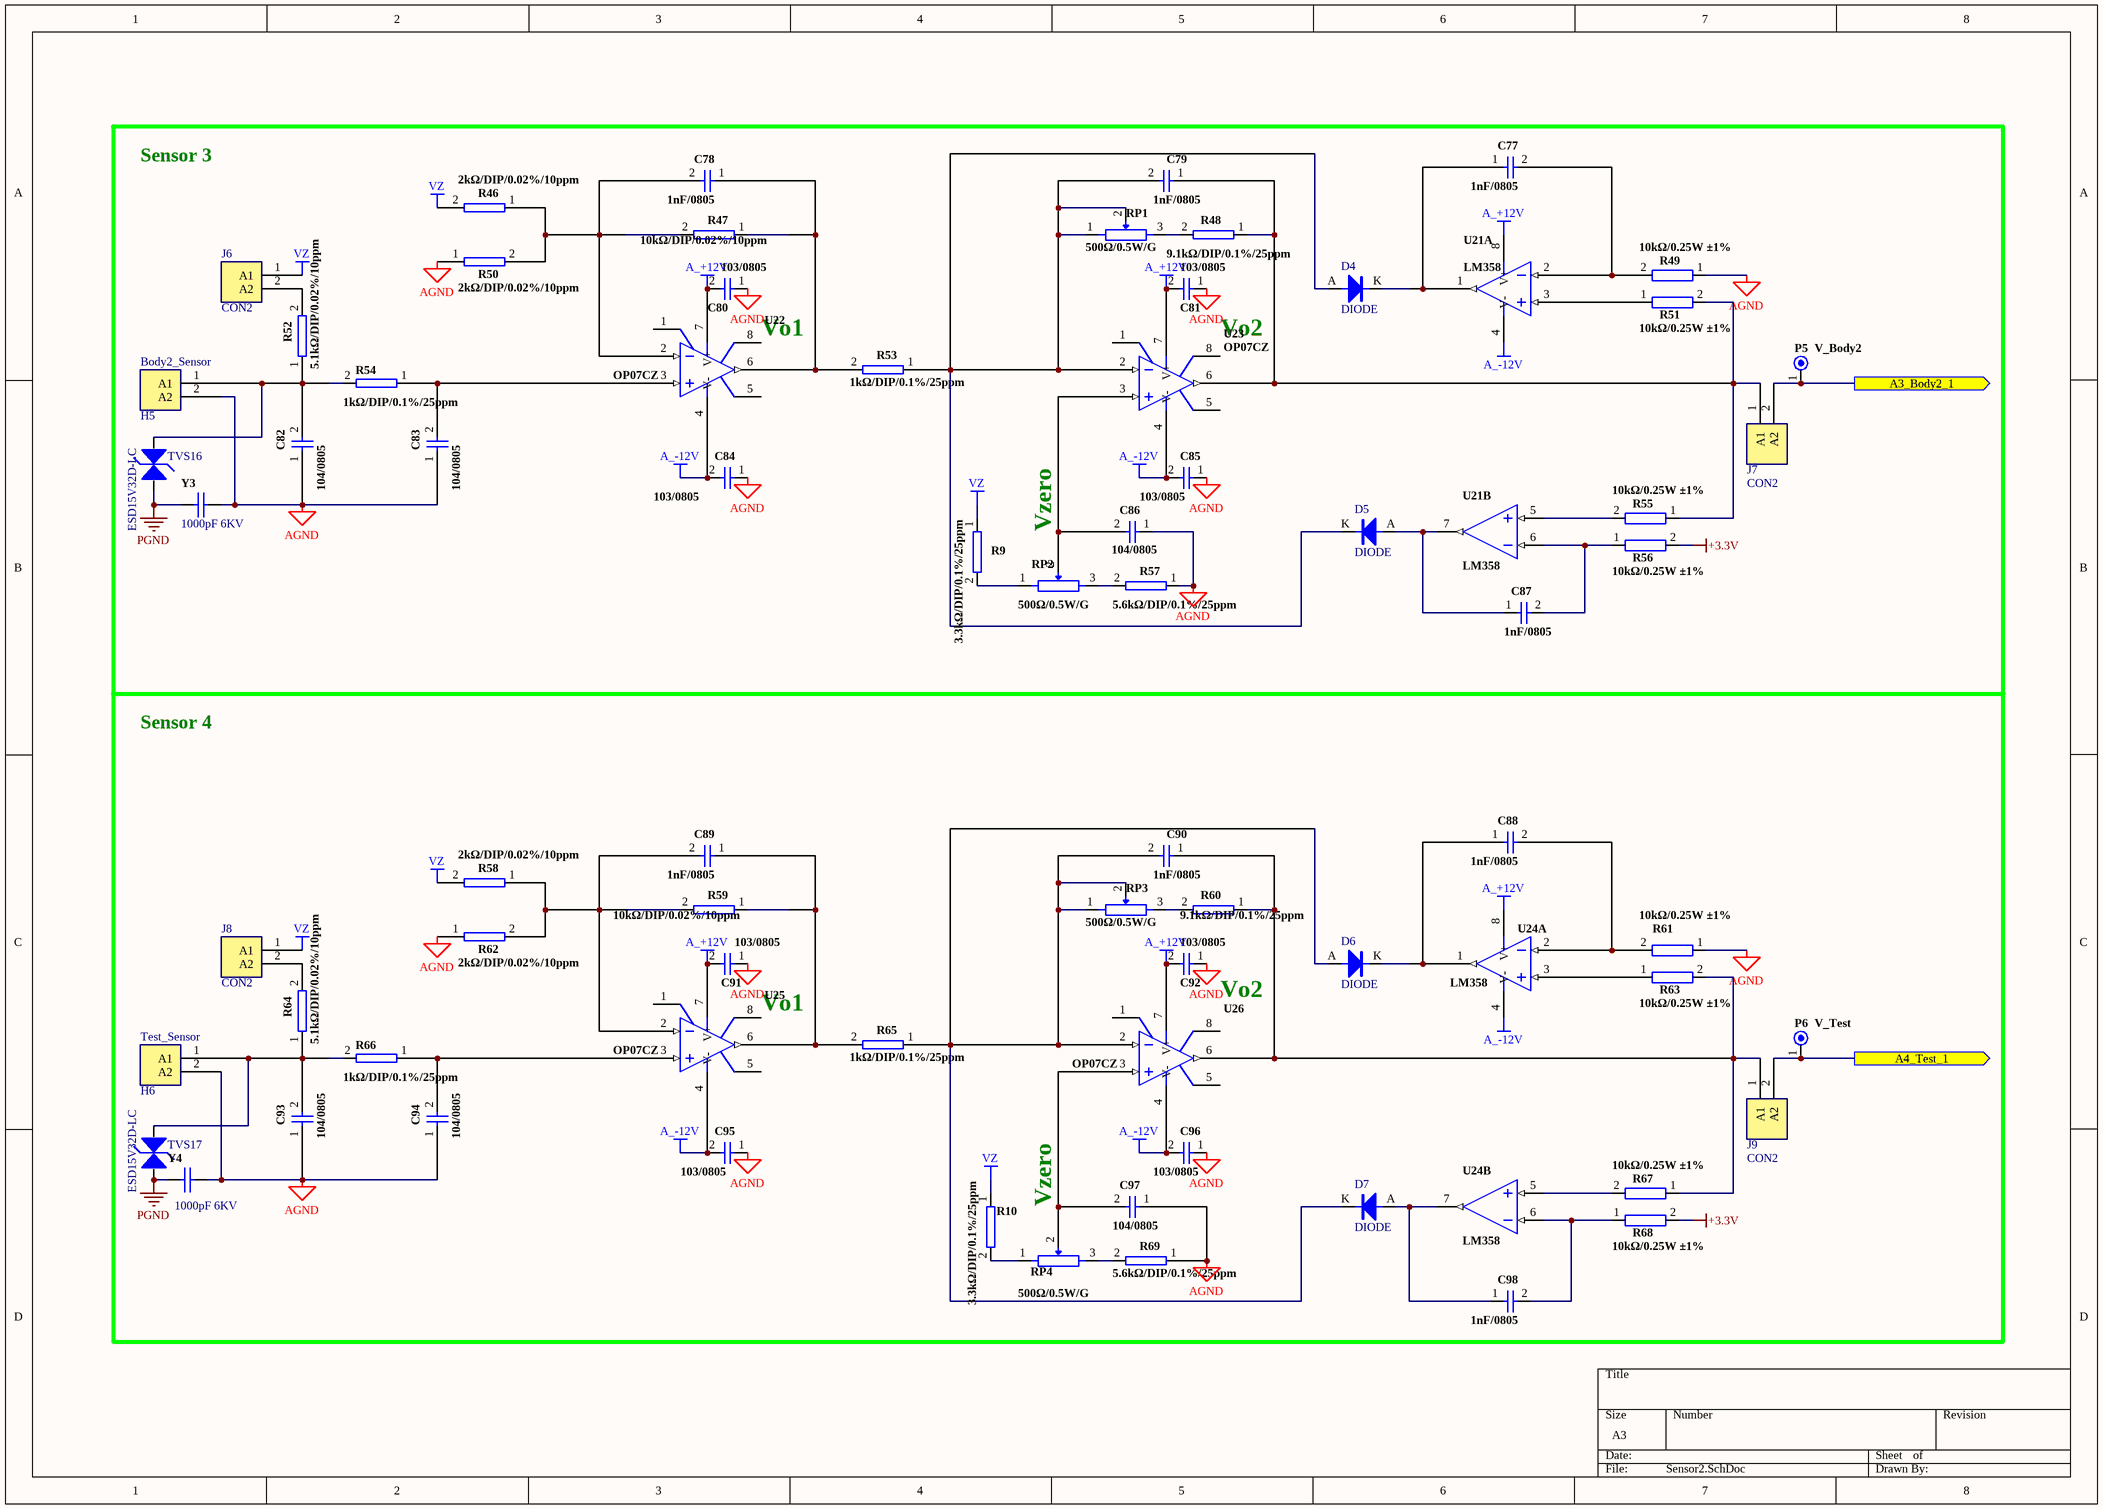
[diagram p6: Sensor2.SchDoc]

### Parts
C77  1nF/0805  [C0805]
C78  1nF/0805  [C0805]
C79  1nF/0805  [C0805]
C80  103/0805  [C0805]
C81  103/0805  [C0805]
C82  104/0805  [C0805]
C83  104/0805  [C0805]
C84  103/0805  [C0805]
C85  103/0805  [C0805]
C86  104/0805  [C0805]
C87  1nF/0805  [C0805]
C88  1nF/0805  [C0805]
C89  1nF/0805  [C0805]
C90  1nF/0805  [C0805]
C91  103/0805  [C0805]
C92  103/0805  [C0805]
C93  104/0805  [C0805]
C94  104/0805  [C0805]
C95  103/0805  [C0805]
C96  103/0805  [C0805]
C97  104/0805  [C0805]
C98  1nF/0805  [C0805]
D4  DIODE  [SOD123]
D5  DIODE  [SOD123]
D6  DIODE  [SOD123]
D7  DIODE  [SOD123]
H5  Body2_Sensor  [XH2]
H6  Test_Sensor  [XH2]
J6  CON2  [2Pin-2.54]
J7  CON2  [2Pin-2.54]
J8  CON2  [2Pin-2.54]
J9  CON2  [2Pin-2.54]
P5  V_Body2  [TESTSMD]
P6  V_Test  [TESTSMD]
R9  3.3kΩ/DIP/0.1%/25ppm  [AXIAL0.4]
R10  3.3kΩ/DIP/0.1%/25ppm  [AXIAL0.4]
R46  2kΩ/DIP/0.02%/10ppm  [AXIAL-0.6-R]
R47  10kΩ/DIP/0.02%/10ppm  [AXIAL-0.6-R]
R48  9.1kΩ/DIP/0.1%/25ppm  [AXIAL0.4]
R49  10kΩ/0.25W ±1%  [R0805]
R50  2kΩ/DIP/0.02%/10ppm  [AXIAL-0.6-R]
R51  10kΩ/0.25W ±1%  [R0805]
R52  5.1kΩ/DIP/0.02%/10ppm  [AXIAL-0.6-R]
R53  1kΩ/DIP/0.1%/25ppm  [AXIAL0.4]
R54  1kΩ/DIP/0.1%/25ppm  [AXIAL0.4]
R55  10kΩ/0.25W ±1%  [R0805]
R56  10kΩ/0.25W ±1%  [R0805]
R57  5.6kΩ/DIP/0.1%/25ppm  [AXIAL0.4]
R58  2kΩ/DIP/0.02%/10ppm  [AXIAL-0.6-R]
R59  10kΩ/DIP/0.02%/10ppm  [AXIAL-0.6-R]
R60  9.1kΩ/DIP/0.1%/25ppm  [AXIAL0.4]
R61  10kΩ/0.25W ±1%  [R0805]
R62  2kΩ/DIP/0.02%/10ppm  [AXIAL-0.6-R]
R63  10kΩ/0.25W ±1%  [R0805]
R64  5.1kΩ/DIP/0.02%/10ppm  [AXIAL-0.6-R]
R65  1kΩ/DIP/0.1%/25ppm  [AXIAL0.4]
R66  1kΩ/DIP/0.1%/25ppm  [AXIAL0.4]
R67  10kΩ/0.25W ±1%  [R0805]
R68  10kΩ/0.25W ±1%  [R0805]
R69  5.6kΩ/DIP/0.1%/25ppm  [AXIAL0.4]
RP1  500Ω/0.5W/G  [3224W]
RP2  500Ω/0.5W/G  [3224W]
RP3  500Ω/0.5W/G  [3224W]
RP4  500Ω/0.5W/G  [3224W]
TVS16  ESD15V32D-LC  [SOD323]
TVS17  ESD15V32D-LC  [SOD323]
U21  LM358  [SO-8]  (parts A,B of 2)
U22  OP07CZ  [SO-8]
U23  OP07CZ  [SO-8]
U24  LM358  [SO-8]  (parts A,B of 2)
U25  OP07CZ  [SO-8]
U26  OP07CZ  [SO-8]
Y3  1000pF 6KV  [CY1002]
Y4  1000pF 6KV  [CY1002]

### Ports
A3_Body2_1 (out), A4_Test_1 (out)

### Nets
+3.3V: R56.2 R68.2
A_+12V: C80.2 C81.2 C91.2 C92.2 U21.8(V+) U22.7(V+) U23.7(V+) U24.8(V+) U25.7(V+) U26.7(V+)
A_-12V: C84.2 C85.2 C95.2 C96.2 U21.4(V-) U22.4(V-) U23.4(V-) U24.4(V-) U25.4(V-) U26.4(V-)
AGND: C80.1 C81.1 C82.1 C83.1 C84.1 C85.1 C86.1 C91.1 C92.1 C93.1 C94.1 C95.1 C96.1 C97.1 H5.2(A2) H6.2(A2) R49.1 R50.1 R57.1 R61.1 R62.1 R69.1 Y3.2 Y4.2
PGND: TVS16.2 TVS17.2 Y3.1 Y4.1
VZ: J6.1(A1) J8.1(A1) R9.1 R10.1 R46.2 R58.2
NetC77_1: C77.1 D4.K U21.1
NetC77_2: C77.2 R49.2 U21.2
NetC78_1: C78.1 R47.1 R53.2 U22.6
NetC78_2: C78.2 R46.1 R47.2 R50.2 U22.2
NetC79_1: C79.1 J7.1(A1) R48.1 R51.2 R55.1 U23.6
NetC79_2: C79.2 D4.A D5.K R53.1 RP1.1 RP1.2 U23.2
NetC82_2: C82.2 H5.1(A1) R52.1 R54.2 TVS16.1
NetC83_2: C83.2 R54.1 U22.3
NetC86_2: C86.2 RP2.2 U23.3
NetC87_1: C87.1 D5.A U21.7
NetC87_2: C87.2 R56.1 U21.6
NetC88_1: C88.1 D6.K U24.1
NetC88_2: C88.2 R61.2 U24.2
NetC89_1: C89.1 R59.1 R65.2 U25.6
NetC89_2: C89.2 R58.1 R59.2 R62.2 U25.2
NetC90_1: C90.1 J9.1(A1) R60.1 R63.2 R67.1 U26.6
NetC90_2: C90.2 D6.A D7.K R65.1 RP3.1 RP3.2 U26.2
NetC93_2: C93.2 H6.1(A1) R64.1 R66.2 TVS17.1
NetC94_2: C94.2 R66.1 U25.3
NetC97_2: C97.2 RP4.2 U26.3
NetC98_1: C98.1 D7.A U24.7
NetC98_2: C98.2 R68.1 U24.6
NetC115_1: J7.2(A2) P5.1 ; port A3_Body2_1
NetC124_1: J9.2(A2) P6.1 ; port A4_Test_1
NetJ6_2: J6.2(A2) R52.2
NetJ8_2: J8.2(A2) R64.2
NetR9_2: R9.2 RP2.1
NetR10_2: R10.2 RP4.1
NetR48_2: R48.2 RP1.3
NetR51_1: R51.1 U21.3
NetR55_2: R55.2 U21.5
NetR57_2: R57.2 RP2.3
NetR60_2: R60.2 RP3.3
NetR63_1: R63.1 U24.3
NetR67_2: R67.2 U24.5
NetR69_2: R69.2 RP4.3

Not connected (* = marked no-connect by the designer): U22 1 5 8; U23 1 5 8; U25 1 5 8; U26 1 5 8

### Notes on the sheet
- Sensor 3
- Vo1
- Vo2
- Vzero
- Sensor 4

### Library data of the parts
C77-C79 C87-C90 C98 = CAP: 贴片电容 1nF/25V ±1% C0805
C80 C81 C84 C85 C91 C92 C95 C96 = CAP: 贴片电容 103/25V ±1% C0805
C82 C83 C86 C93 C94 C97 = CAP: 贴片电容 104/25V ±1% C0805
D4-D7 = DIODE: 高速开关二极管 IN4148 1V 150mA SOD123
H5 H6 = CON2: 插座式端子 XH2.54-2P 250V(DC/AC) 3A
J6-J9 = CON2: 单排排针（2针）2.54mm 2Pin-2.54
P5 P6 = CON1
R9 R10 = RES2: 高精度电阻 3.3kΩ DIP 0.25W ±0.1% 25ppm AXIAL0.4
R46 R50 R58 R62 = RES2: 高精度电阻 2kΩ DIP 0.25W ±0.02% 10ppm AXIAL-0.6-R
R47 R59 = RES2: 高精度电阻 10kΩ DIP 0.25W ±0.02% 10ppm AXIAL-0.6-R
R48 R60 = RES2: 高精度电阻 9.1kΩ DIP 0.25W ±0.1% 25ppm AXIAL0.4
R49 R51 R55 R56 R61 R63 R67 R68 = RES2: 贴片电阻 10kΩ 0.25W ±1% R0805
R52 R64 = RES2: 高精度电阻 5.1kΩ DIP 0.25W ±0.02% 10ppm AXIAL-0.6-R
R53 R54 R65 R66 = RES2: 高精度电阻 1kΩ DIP 0.25W ±0.1% 25ppm AXIAL0.4
R57 R69 = RES2: 高精度电阻 5.6kΩ DIP 0.25W ±0.1% 25ppm AXIAL0.4
RP1-RP4 = RPOT: 高精密可调电位器 500Ω/0.5W/G 3224W
TVS16 TVS17 = TVS: as TVS18 on sheet Sensor
U21 U24 = MC1458D: 双运算放大器 LM358 SO-8
U22 U23 U25 U26 = OP07CZ: 运算放大器 OP07CZ SO-8
Y3 Y4 = CAP: as Y5 on sheet Sensor; 物: *; 部: *; 供: *

## Sheet ADC_Isolation.SchDoc
size A3
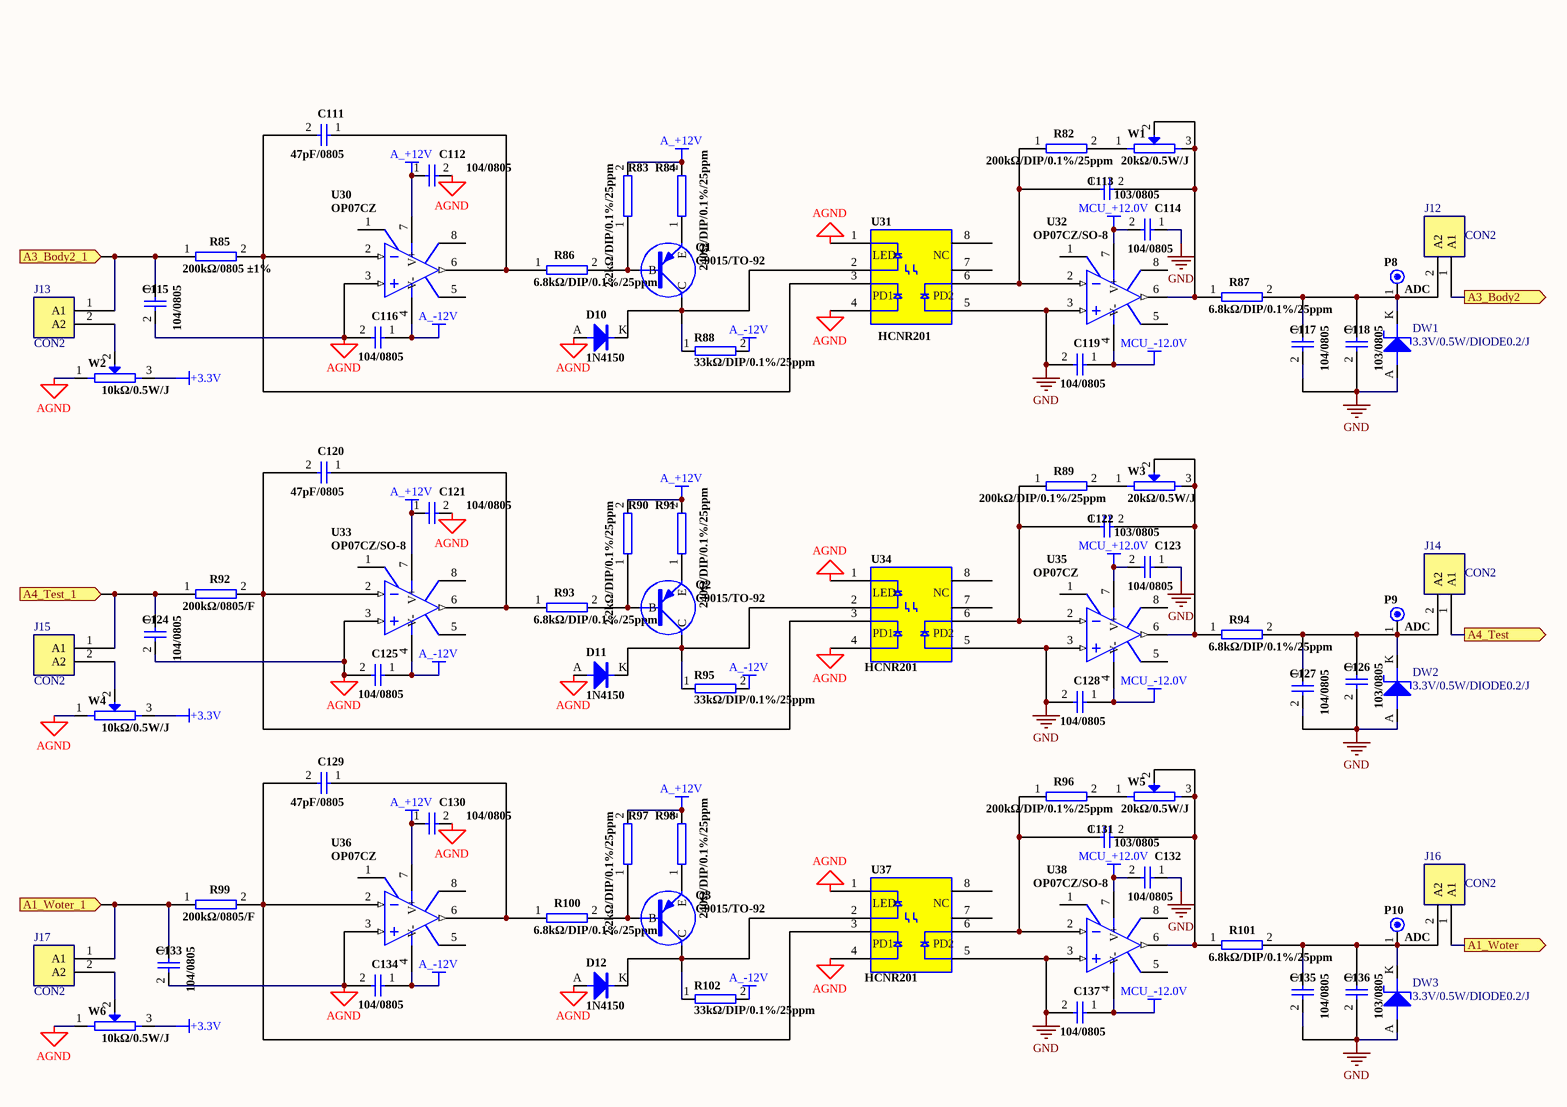
[diagram p7: ADC_Isolation.SchDoc]

### Parts
C111  47pF/0805  [C0805]
C112  104/0805  [C0805]
C113  103/0805  [C0805]
C114  104/0805  [C0805]
C115  104/0805  [C0805]
C116  104/0805  [C0805]
C117  104/0805  [C0805]
C118  103/0805  [C0805]
C119  104/0805  [C0805]
C120  47pF/0805  [C0805]
C121  104/0805  [C0805]
C122  103/0805  [C0805]
C123  104/0805  [C0805]
C124  104/0805  [C0805]
C125  104/0805  [C0805]
C126  103/0805  [C0805]
C127  104/0805  [C0805]
C128  104/0805  [C0805]
C129  47pF/0805  [C0805]
C130  104/0805  [C0805]
C131  103/0805  [C0805]
C132  104/0805  [C0805]
C133  104/0805  [C0805]
C134  104/0805  [C0805]
C135  104/0805  [C0805]
C136  103/0805  [C0805]
C137  104/0805  [C0805]
D10  1N4150  [DIODE0.2]
D11  1N4150  [DIODE0.2]
D12  1N4150  [DIODE0.2]
DW1  3.3V/0.5W/DIODE0.2/J  [DIODE0.2]
DW2  3.3V/0.5W/DIODE0.2/J  [DIODE0.2]
DW3  3.3V/0.5W/DIODE0.2/J  [DIODE0.2]
J12  CON2  [2Pin-2.54]
J13  CON2  [2Pin-2.54]
J14  CON2  [2Pin-2.54]
J15  CON2  [2Pin-2.54]
J16  CON2  [2Pin-2.54]
J17  CON2  [2Pin-2.54]
P8  ADC  [TESTSMD]
P9  ADC  [TESTSMD]
P10  ADC  [TESTSMD]
Q1  C9015/TO-92  [TO-92]
Q2  C9015/TO-92  [TO-92]
Q3  C9015/TO-92  [TO-92]
R82  200kΩ/DIP/0.1%/25ppm  [AXIAL0.4]
R83  2.2kΩ/DIP/0.1%/25ppm  [AXIAL0.4]
R84  240Ω/DIP/0.1%/25ppm  [AXIAL0.4]
R85  200kΩ/0805 ±1%  [R0805]
R86  6.8kΩ/DIP/0.1%/25ppm  [AXIAL0.4]
R87  6.8kΩ/DIP/0.1%/25ppm  [AXIAL0.4]
R88  33kΩ/DIP/0.1%/25ppm  [AXIAL0.4]
R89  200kΩ/DIP/0.1%/25ppm  [AXIAL0.4]
R90  2.2kΩ/DIP/0.1%/25ppm  [AXIAL0.4]
R91  240Ω/DIP/0.1%/25ppm  [AXIAL0.4]
R92  200kΩ/0805/F  [R0805]
R93  6.8kΩ/DIP/0.1%/25ppm  [AXIAL0.4]
R94  6.8kΩ/DIP/0.1%/25ppm  [AXIAL0.4]
R95  33kΩ/DIP/0.1%/25ppm  [AXIAL0.4]
R96  200kΩ/DIP/0.1%/25ppm  [AXIAL0.4]
R97  2.2kΩ/DIP/0.1%/25ppm  [AXIAL0.4]
R98  240Ω/DIP/0.1%/25ppm  [AXIAL0.4]
R99  200kΩ/0805/F  [R0805]
R100  6.8kΩ/DIP/0.1%/25ppm  [AXIAL0.4]
R101  6.8kΩ/DIP/0.1%/25ppm  [AXIAL0.4]
R102  33kΩ/DIP/0.1%/25ppm  [AXIAL0.4]
U30  OP07CZ  [SO-8]
U31  HCNR201  [DIP08W]
U32  OP07CZ/SO-8  [SO-8]
U33  OP07CZ/SO-8  [SO-8]
U34  HCNR201  [DIP08W]
U35  OP07CZ  [SO-8]
U36  OP07CZ  [SO-8]
U37  HCNR201  [DIP08W]
U38  OP07CZ/SO-8  [SO-8]
W1  20kΩ/0.5W/J  [3224W]
W2  10kΩ/0.5W/J  [3224W]
W3  20kΩ/0.5W/J  [3224W]
W4  10kΩ/0.5W/J  [3224W]
W5  20kΩ/0.5W/J  [3224W]
W6  10kΩ/0.5W/J  [3224W]

### Ports
A1_Woter (out), A1_Woter_1 (in), A3_Body2 (out), A3_Body2_1 (in), A4_Test (out), A4_Test_1 (in)

### Nets
+3.3V: W2.3 W4.3 W6.3
A_+12V: C112.1 C121.1 C130.1 R83.2 R84.2 R90.2 R91.2 R97.2 R98.2 U30.7(V+) U33.7(V+) U36.7(V+)
A_-12V: C116.1 C125.1 C134.1 R88.2 R95.2 R102.2 U30.4(V-) U33.4(V-) U36.4(V-)
AGND: C112.2 C115.2 C116.2 C121.2 C124.2 C125.2 C130.2 C133.2 C134.2 D10.A D11.A D12.A U30.3 U31.1 U31.4 U33.3 U34.1 U34.4 U36.3 U37.1 U37.4 W2.1 W4.1 W6.1
GND: C114.1 C117.2 C118.2 C119.2 C123.1 C126.2 C127.2 C128.2 C132.1 C135.2 C136.2 C137.2 DW1.A DW2.A DW3.A U31.5 U32.3 U34.5 U35.3 U37.5 U38.3
MCU_+12.0V: C114.2 C123.2 C132.2 U32.7(V+) U35.7(V+) U38.7(V+)
MCU_-12.0V: C119.1 C128.1 C137.1 U32.4(V-) U35.4(V-) U38.4(V-)
ADC1: J12.1(A1) ; port A3_Body2
ADC2: J14.1(A1) ; port A4_Test
ADC3: J16.1(A1) ; port A1_Woter
NetC111_1: C111.1 R86.1 U30.6
NetC111_2: C111.2 R85.2 U30.2 U31.3
NetC113_1: C113.1 R82.1 U31.6 U32.2
NetC113_2: C113.2 R87.1 U32.6 W1.2 W1.3
NetC115_1: C115.1 J13.1(A1) R85.1 ; port A3_Body2_1
NetC117_1: C117.1 C118.1 DW1.K J12.2(A2) P8.1 R87.2
NetC120_1: C120.1 R93.1 U33.6
NetC120_2: C120.2 R92.2 U33.2 U34.3
NetC122_1: C122.1 R89.1 U34.6 U35.2
NetC122_2: C122.2 R94.1 U35.6 W3.2 W3.3
NetC124_1: C124.1 J15.1(A1) R92.1 ; port A4_Test_1
NetC126_1: C126.1 C127.1 DW2.K J14.2(A2) P9.1 R94.2
NetC129_1: C129.1 R100.1 U36.6
NetC129_2: C129.2 R99.2 U36.2 U37.3
NetC131_1: C131.1 R96.1 U37.6 U38.2
NetC131_2: C131.2 R101.1 U38.6 W5.2 W5.3
NetC133_1: C133.1 J17.1(A1) R99.1 ; port A1_Woter_1
NetC135_1: C135.1 C136.1 DW3.K J16.2(A2) P10.1 R101.2
NetD10_K: D10.K Q1.3(C) R88.1 U31.2
NetD11_K: D11.K Q2.3(C) R95.1 U34.2
NetD12_K: D12.K Q3.3(C) R102.1 U37.2
NetJ13_2: J13.2(A2) W2.2
NetJ15_2: J15.2(A2) W4.2
NetJ17_2: J17.2(A2) W6.2
NetQ1_1: Q1.1(B) R83.1 R86.2
NetQ1_2: Q1.2(E) R84.1
NetQ2_1: Q2.1(B) R90.1 R93.2
NetQ2_2: Q2.2(E) R91.1
NetQ3_1: Q3.1(B) R97.1 R100.2
NetQ3_2: Q3.2(E) R98.1
NetR82_2: R82.2 W1.1
NetR89_2: R89.2 W3.1
NetR96_2: R96.2 W5.1

Not connected (* = marked no-connect by the designer): U30 1 5 8; U31 7 8; U32 1 5 8; U33 1 5 8; U34 7 8; U35 1 5 8; U36 1 5 8; U37 7 8; U38 1 5 8

### Notes on the sheet
- (in symbol HCNR201) LED; NC; PD1; PD2

### Library data of the parts
C111 C120 C129 = CAP: 贴片电容 47pF/25V ±1% C0805
C112 C114-C117 C119 C121 C123-C125 C127 C128 C130 C132-C135 C137 = CAP: 贴片电容 104/25V ±1% C0805
C113 C118 C122 C126 C131 C136 = CAP: 贴片电容 103/25V ±1% C0805
D10-D12 = DIODE0: 快速开关二极管 1N415050V 450mA/J /DIODE0.2
DW1-DW3 = ZENER0: 稳压二极管 3.3V/0.5W/DIODE0.2/J
J12-J17 = CON2: 单排排针（2针）2.54mm 2Pin-2.54
P8-P10 = CON1
Q1-Q3 = PNP: 三极管 C9015 TO-92
R82 R89 R96 = RES2: 高精度电阻 200kΩ DIP ±0.1% 25ppm AXIAL0.4
R83 R90 R97 = RES2: 高精度电阻 2.2kΩ DIP ±0.1% 25ppm AXIAL0.4
R84 R91 R98 = RES2: 高精度电阻 240Ω DIP ±0.1% 25ppm AXIAL0.4
R85 R92 R99 = RES2: 贴片电阻 200kΩ 0.25W ±1% R0805
R86 R87 R93 R94 R100 R101 = RES2: 高精度电阻 6.8kΩ DIP ±0.1% 25ppm AXIAL0.4
R88 R95 R102 = RES2: 高精度电阻 33kΩ DIP ±0.1% 25ppm AXIAL0.4
U30 U32 U33 U35 U36 U38 = OP07CZ: 运算放大器 OP07CZ SO-8
U31 U34 U37 = HCNR201: 线性光耦隔离器 HCNR201 DIP08W
W1 W3 W5 = RPOT: 高精密可调电位器 20kΩ/0.5W/J  3224W
W2 W4 W6 = RPOT: 高精密可调电位器 10kΩ/0.5W/J  3224W

## Sheet MCUPOWER.SchDoc
size A3
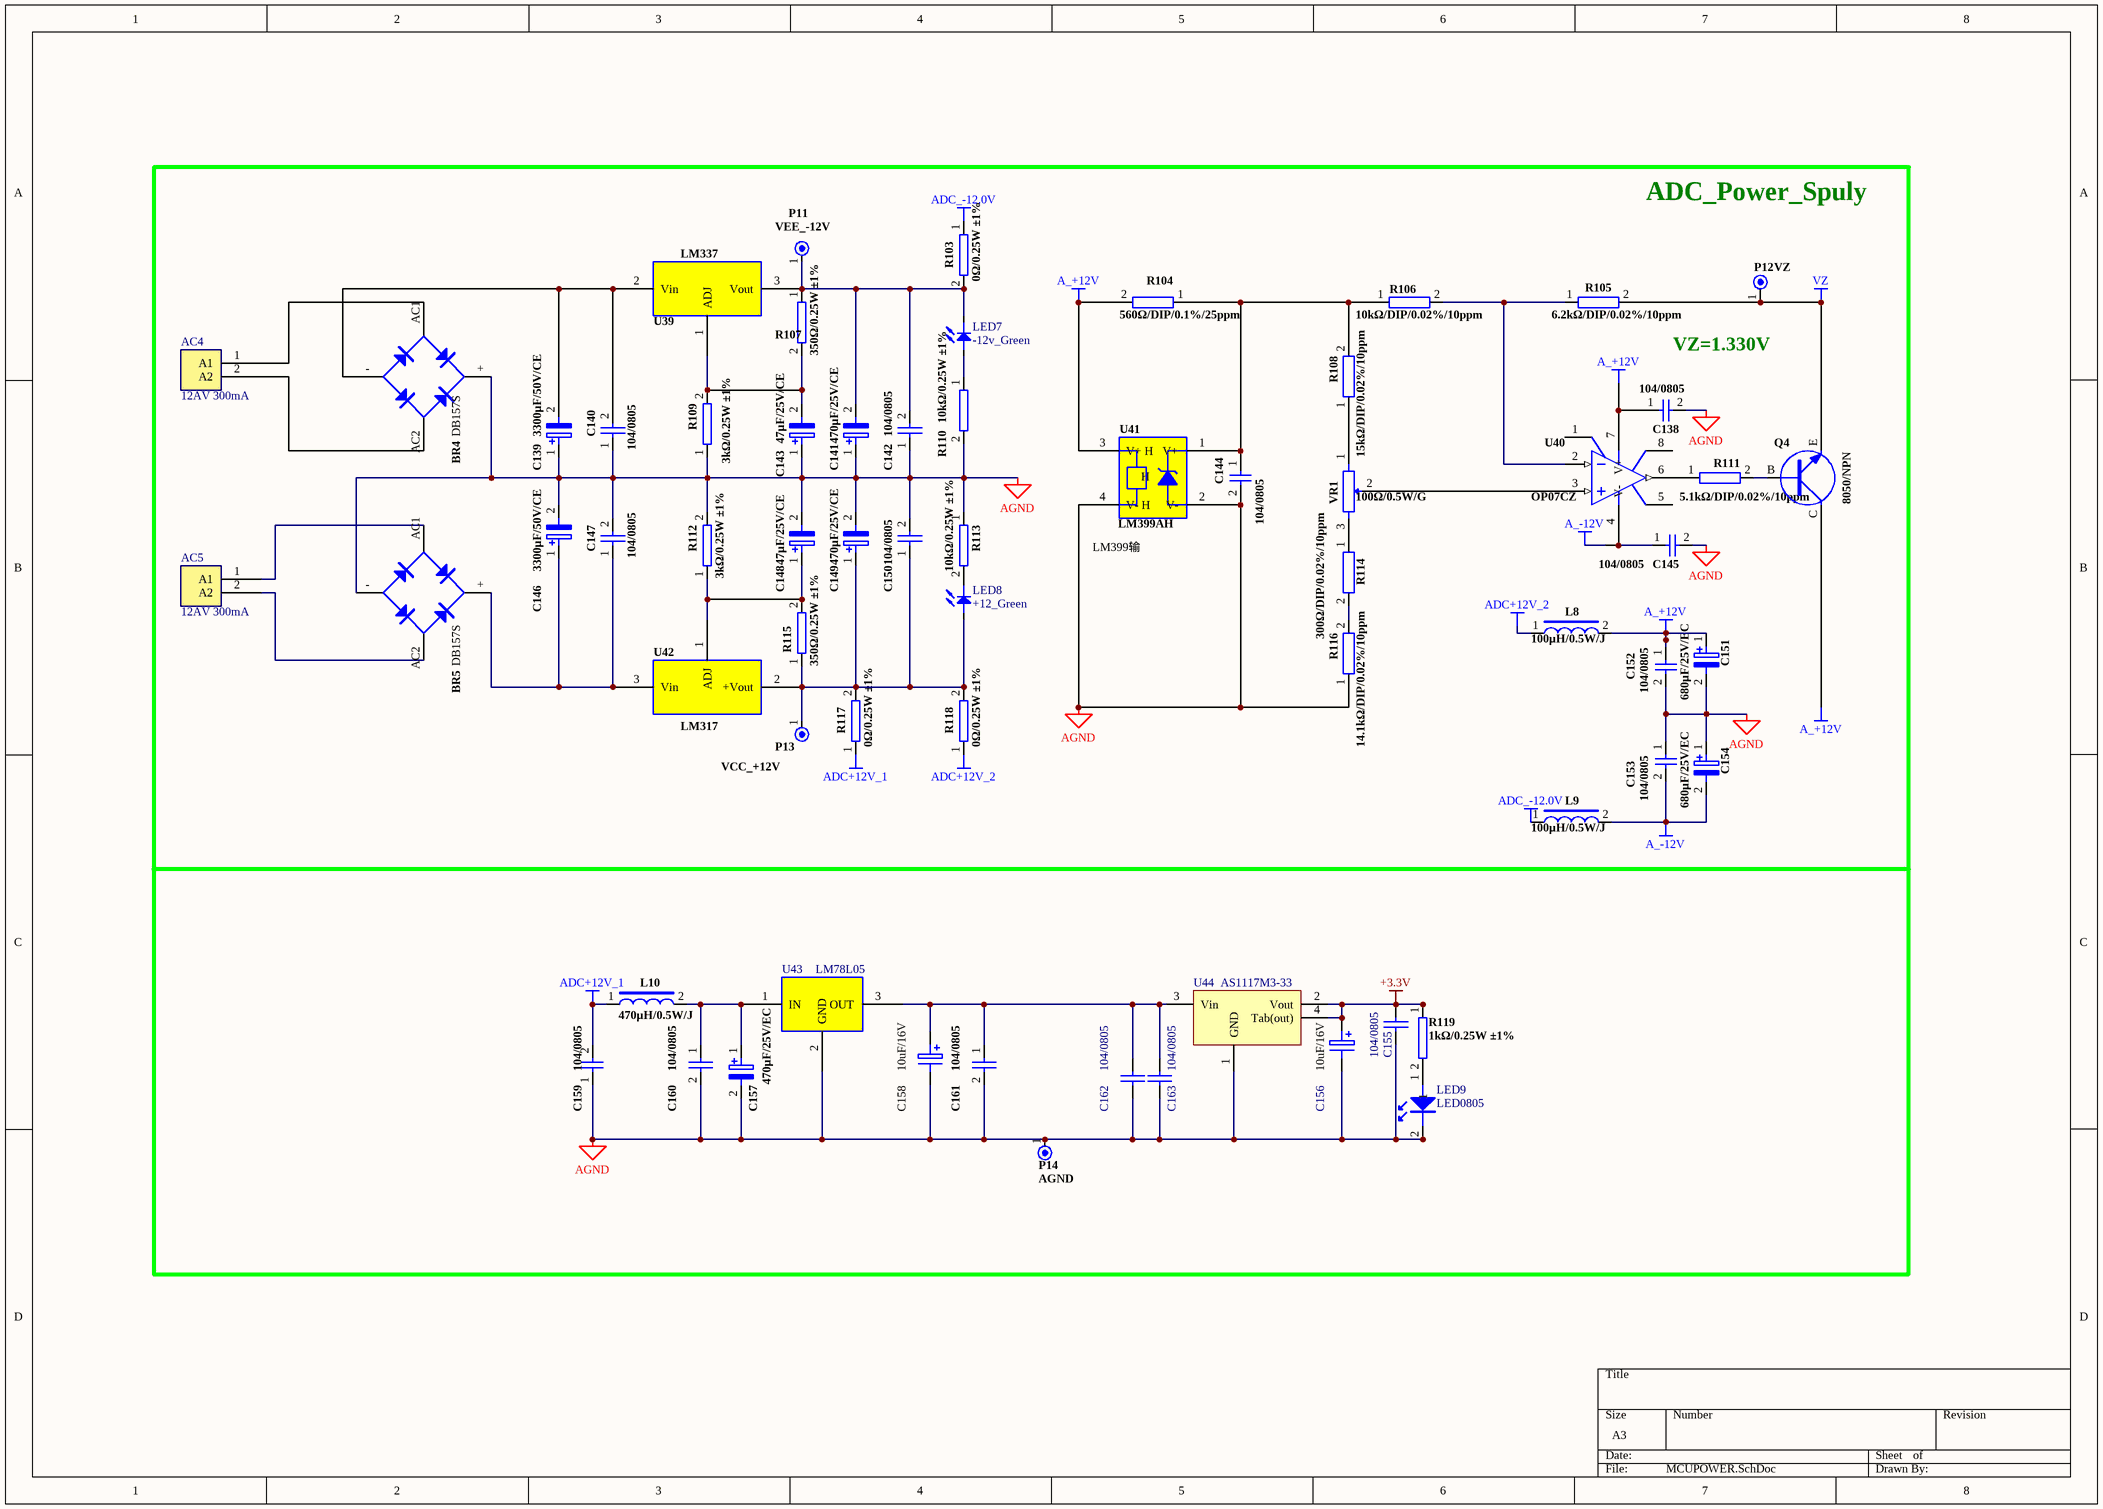
[diagram p8: MCUPOWER.SchDoc]

### Parts
AC4  12AV 300mA  [HEADER2]
AC5  12AV 300mA  [HEADER2]
BR4  DB157S  [DB157S]
BR5  DB157S  [DB157S]
C138  104/0805  [C0805]
C139  3300μF/50V/CE  [RB.3/.6]
C140  104/0805  [C0805]
C141  470μF/25V/CE  [RB.2/.4]
C142  104/0805  [C0805]
C143  47μF/25V/CE  [RB.1/.2]
C144  104/0805  [C0805]
C145  104/0805  [C0805]
C146  3300μF/50V/CE  [RB.3/.6]
C147  104/0805  [C0805]
C148  47μF/25V/CE  [RB.1/.2]
C149  470μF/25V/CE  [RB.2/.4]
C150  104/0805  [C0805]
C151  680μF/25V/EC  [RB.2/.4]
C152  104/0805  [C0805]
C153  104/0805  [C0805]
C154  680μF/25V/EC  [RB.2/.4]
C155  104/0805  [C0805]
C156  10uF/16V  [C3216]
C157  470μF/25V/EC  [RB.2/.4]
C158  10uF/16V  [C3216]
C159  104/0805  [C0805]
C160  104/0805  [C0805]
C161  104/0805  [C0805]
C162  104/0805  [C0805]
C163  104/0805  [C0805]
L8  100μH/0.5W/J  [AXIAL0.4]
L9  100μH/0.5W/J  [AXIAL0.4]
L10  470μH/0.5W/J  [AXIAL0.4]
LED7  -12v_Green  [LED_0805]
LED8  +12_Green  [LED_0805]
LED9  LED0805  [LED_0805]
P11  VEE_-12V  [TESTSMD]
P12  VZ  [TESTSMD]
P13  VCC_+12V  [TESTSMD]
P14  AGND  [TESTSMD]
Q4  8050/NPN  [TO92A]
R103  0Ω/0.25W ±1%  [R0805]
R104  560Ω/DIP/0.1%/25ppm  [AXIAL-0.6-R]
R105  6.2kΩ/DIP/0.02%/10ppm  [AXIAL-0.6-R]
R106  10kΩ/DIP/0.02%/10ppm  [AXIAL-0.6-R]
R107  350Ω/0.25W ±1%  [R0805]
R108  15kΩ/DIP/0.02%/10ppm  [AXIAL-0.6-R]
R109  3kΩ/0.25W ±1%  [R0805]
R110  10kΩ/0.25W ±1%  [R0805]
R111  5.1kΩ/DIP/0.02%/10ppm  [AXIAL-0.6-R]
R112  3kΩ/0.25W ±1%  [R0805]
R113  10kΩ/0.25W ±1%  [R0805]
R114  300Ω/DIP/0.02%/10ppm  [AXIAL-0.6-R]
R115  350Ω/0.25W ±1%  [R0805]
R116  14.1kΩ/DIP/0.02%/10ppm  [AXIAL-0.6-R]
R117  0Ω/0.25W ±1%  [R0805]
R118  0Ω/0.25W ±1%  [R0805]
R119  1kΩ/0.25W ±1%  [R0805]
U39  LM337  [TO220H]
U40  OP07CZ  [SO-8]
U41  LM399AH  [LM399]
U42  LM317  [TO220H]
U43  LM78L05  [TO-220]
U44  AS1117M3-33  [SOT-223-3L(M3)]
VR1  100Ω/0.5W/G  [3224W]

### Nets
+3.3V: C155.1 C156.1 R119.1 U44.2(Vout) U44.4(Tab(out))
A_+12V: C138.1 C151.1 C152.1 L8.2 Q4.C R104.2 U40.7(V+) U41.3(V+_H)
A_-12V: C145.1 C153.2 C154.2 L9.2 U40.4(V-)
ADC+12V_1: C159.2 L10.1 R117.1
ADC+12V_2: L8.1 R118.1
ADC_-12.0V: L9.1 R103.1
AGND: BR4.+(V+) BR5.-(V-) C138.2 C139.1 C140.1 C141.1 C142.1 C143.1 C144.2 C145.2 C146.2 C147.2 C148.2 C149.2 C150.2 C151.2 C152.2 C153.1 C154.1 C155.2 C156.2 C157.2 C158.2 C159.1 C160.2 C161.2 C162.2 C163.2 LED9.2 P14.1 R109.1 R110.2 R112.2 R113.1 R116.1 U41.2(V-) U41.4(V-_H) U43.2(GND) U44.1(GND)
VZ: P12.1 Q4.E R105.2
NetAC4_1: AC4.1(A1) BR4.AC1
NetAC4_2: AC4.2(A2) BR4.AC2
NetAC5_1: AC5.1(A1) BR5.AC1
NetAC5_2: AC5.2(A2) BR5.AC2
NetBR4_-: BR4.-(V-) C139.2 C140.2 U39.2(Vin)
NetBR5_+: BR5.+(V+) C146.1 C147.1 U42.3(Vin)
NetC141_2: C141.2 C142.2 LED7.2 P11.1 R103.2 R107.1 U39.3(Vout)
NetC143_2: C143.2 R107.2 R109.2 U39.1(ADJ)
NetC144_1: C144.1 R104.1 R106.1 R108.2 U41.1(V+)
NetC148_1: C148.1 R112.1 R115.2 U42.1(ADJ)
NetC149_1: C149.1 C150.1 LED8.1 P13.1 R115.1 R117.2 R118.2 U42.2(+Vout)
NetC157_1: C157.1 C160.1 L10.2 U43.1(IN)
NetC158_1: C158.1 C161.1 C162.1 C163.1 U43.3(OUT) U44.3(Vin)
NetLED7_1: LED7.1 R110.1
NetLED8_2: LED8.2 R113.2
NetLED9_1: LED9.1 R119.2
NetQ4_B: Q4.B R111.2
NetR105_1: R105.1 R106.2 U40.2
NetR108_1: R108.1 VR1.1
NetR111_1: R111.1 U40.6
NetR114_1: R114.1 VR1.3
NetR114_2: R114.2 R116.2
NetU40_3: U40.3 VR1.2

Not connected (* = marked no-connect by the designer): U40 1 5 8

### Notes on the sheet
- ADC_Power_Spuly
- VZ=1.330V
- (near U41) LM399输
- (in symbol LM399AH) H

### Library data of the parts
AC4 AC5 = CON2: 接线端子 AWG14-22 300VA 16A 5.0mm HEADER2
BR4 BR5 = NBRIDGE1: 贴片整流桥 DB157S 50A/1000V
C138 C140 C142 C144 C145 C147 C150 C152 C153 C155 C159-C163 = CAP: 贴片电容 104/25V ±1% C0805
  C162 C163: value: *
C139 C146 = ELECTRO2: 电解电容 3300μF/50V/CE ±10% RB.3/.6
C141 C149 = ELECTRO2: 电解电容 470μF/25V/CE ±10% RB.2/.4
C143 C148 = ELECTRO2: 电解电容 47μF/25V/CE ±10% RB.1/.2
C151 C154 = ELECTRO2: 电解电容 680μF/25V/EC ±10% RB.2/.4
C156 = ELECTRO1: 贴片钽电容 10uF/16V ±10% C3216
C157 = ELECTRO2: 电解电容 470μF/25V/EC ±10% RB.2/.4
C158 = ELECTRO1: 贴片钽电容 10uF/16V ±1% C3216
L8 L9 = INDUCTOR2: 直插电感 100μH/0.5W ±5% AXIAL0.4
L10 = INDUCTOR2: 直插电感 470μH/0.5W ±5% AXIAL0.4
LED7 LED8 = B_LED: 贴片LED灯 绿色 2.0V 20mA LED_0805
LED9 = LED0805: 贴片LED灯 蓝色 2.0V 20mA LED_0805
P11-P14 = CON1: 测试点
Q4 = NPN: 三极管 8050/NPN TO92A
R103 R117 R118 = RES2: 贴片电阻 0Ω 0.25W ±1% R0805
R104 = RES2: 高精度电阻 560Ω DIP 1W ±0.1% 25ppm AXIAL-0.6-R
R105 = RES3: 高精度电阻 6.2kΩ DIP 1W ±0.02% 10ppm AXIAL-0.6-R
R106 = RES3: 高精度电阻 10kΩ DIP 1W ±0.02% 10ppm AXIAL-0.6-R
R107 R115 = RES2: 贴片电阻 350Ω 0.25W ±1% R0805
R108 = RES3: 高精度电阻 15kΩ DIP 1W ±0.02% 10ppm AXIAL-0.6-R
R109 R112 = RES2: 贴片电阻 3kΩ 0.25W ±1% R0805
R110 R113 = RES2: 贴片电阻 10kΩ 0.25W ±1% R0805
R111 = RES2: 高精度电阻 5.1kΩ DIP 1W ±0.02% 10ppm AXIAL-0.6-R
R114 = RES2: 高精度电阻 300Ω DIP 1W ±0.02% 10ppm AXIAL-0.6-R
R116 = RES3: 高精度电阻 14.1kΩ DIP 1W ±0.02% 10ppm AXIAL-0.6-R
R119 = RES2: as R43 on sheet AD_POWER
U39 = LM337: 线性可调稳压IC LM337 TO220H
U40 = OP07CZ: 运算放大器 OP07CZ SO-8
U41 = LM399AH: 高精度电压比较器 LM399AH TO46-4
U42 = LM317: 线性可调稳压IC LM317 TO220H
U43 = LM78L05: 线性稳压芯片 LM78L05 TO-220
U44 = AS1117M3-33: 线性稳压管 AS1117M3-33 SOT-223; 物?: *; 部?: *; 供?: *
VR1 = RPOT: 高精密可调电位器 100Ω 0.5W/G 3224W

## Nets that join several sheets
3.3V: CPU_Control (31 pins), UART_Control (9 pins), AD_POWER (5 pins)
5V: CPU_Control (5 pins), AD_POWER (6 pins)
+3.3V: Sensor (R80.2), Sensor2 (R56.2 R68.2), ADC_Isolation (W2.3 W4.3 W6.3), MCUPOWER (5 pins)
A_+12V: Sensor (5 pins), Sensor2 (10 pins), ADC_Isolation (12 pins), MCUPOWER (8 pins)
A_-12V: Sensor (5 pins), Sensor2 (10 pins), ADC_Isolation (9 pins), MCUPOWER (5 pins)
AGND: Sensor (12 pins), Sensor2 (24 pins), ADC_Isolation (24 pins), MCUPOWER (39 pins)
GND: CPU_Control (50 pins), UART_Control (5 pins), AD_POWER (37 pins), ADC_Isolation (21 pins)
MCU_+12.0V: AD_POWER (C52.1 C53.1 L5.2), ADC_Isolation (6 pins)
MCU_-12.0V: AD_POWER (C59.2 C60.2 L6.2), ADC_Isolation (6 pins)
PGND: Sensor (TVS18.2 Y5.1), Sensor2 (TVS16.2 TVS17.2 Y3.1 Y4.1)
SC_5V: POWER_Control (R24.1), UART_Control (20 pins)
SC_12V: POWER_Control (10 pins), UART_Control (P2.1 P2.3)
SC_GND: CPU_Control (J1.1 OP1.E), POWER_Control (25 pins), UART_Control (21 pins)
VREF+: CPU_Control (C16.2 C17.2 U2.21), AD_POWER (C76.1 U19.2)
VZ: Sensor (J10.1 R70.2 R81.1), Sensor2 (6 pins), MCUPOWER (P12.1 Q4.E R105.2)
ADC1: CPU_Control (U2.24), ADC_Isolation (J12.1)
ADC2: CPU_Control (U2.25), ADC_Isolation (J14.1)
ADC3: CPU_Control (U2.26), ADC_Isolation (J16.1)
NetC115_1: Sensor2 (J7.2 P5.1), ADC_Isolation (C115.1 J13.1 R85.1)
NetC124_1: Sensor2 (J9.2 P6.1), ADC_Isolation (C124.1 J15.1 R92.1)
NetC133_1: Sensor (J11.2 P7.1), ADC_Isolation (C133.1 J17.1 R99.1)
NetR27_1: CPU_Control (U2.48), UART_Control (R27.1 U11.2)
NetR28_1: CPU_Control (U2.47), UART_Control (R28.1 U11.3)
NetR31_1: CPU_Control (U2.68), UART_Control (R31.1)
NetR32_1: CPU_Control (U2.69), UART_Control (R32.1)
NetU2_86: CPU_Control (U2.86), UART_Control (U9.3)
NetU2_87: CPU_Control (U2.87), UART_Control (U9.2)
Pc12: CPU_Control (U2.80), UART_Control (U12.3)
PD2: CPU_Control (U2.83), UART_Control (U12.2)
UART4_RX: CPU_Control (U2.79), UART_Control (R29.1 U15.2)
UART4_TX: CPU_Control (U2.78), UART_Control (R30.1 U15.3)